# EAGLE design logic (EAGLE 9.3.1)
IGVC Motor Control Board
REVISION: v1.2; SCH_DESC: Logic Board; TEAM: IGVC

## Sheet 1 of 5: mBed Breakout
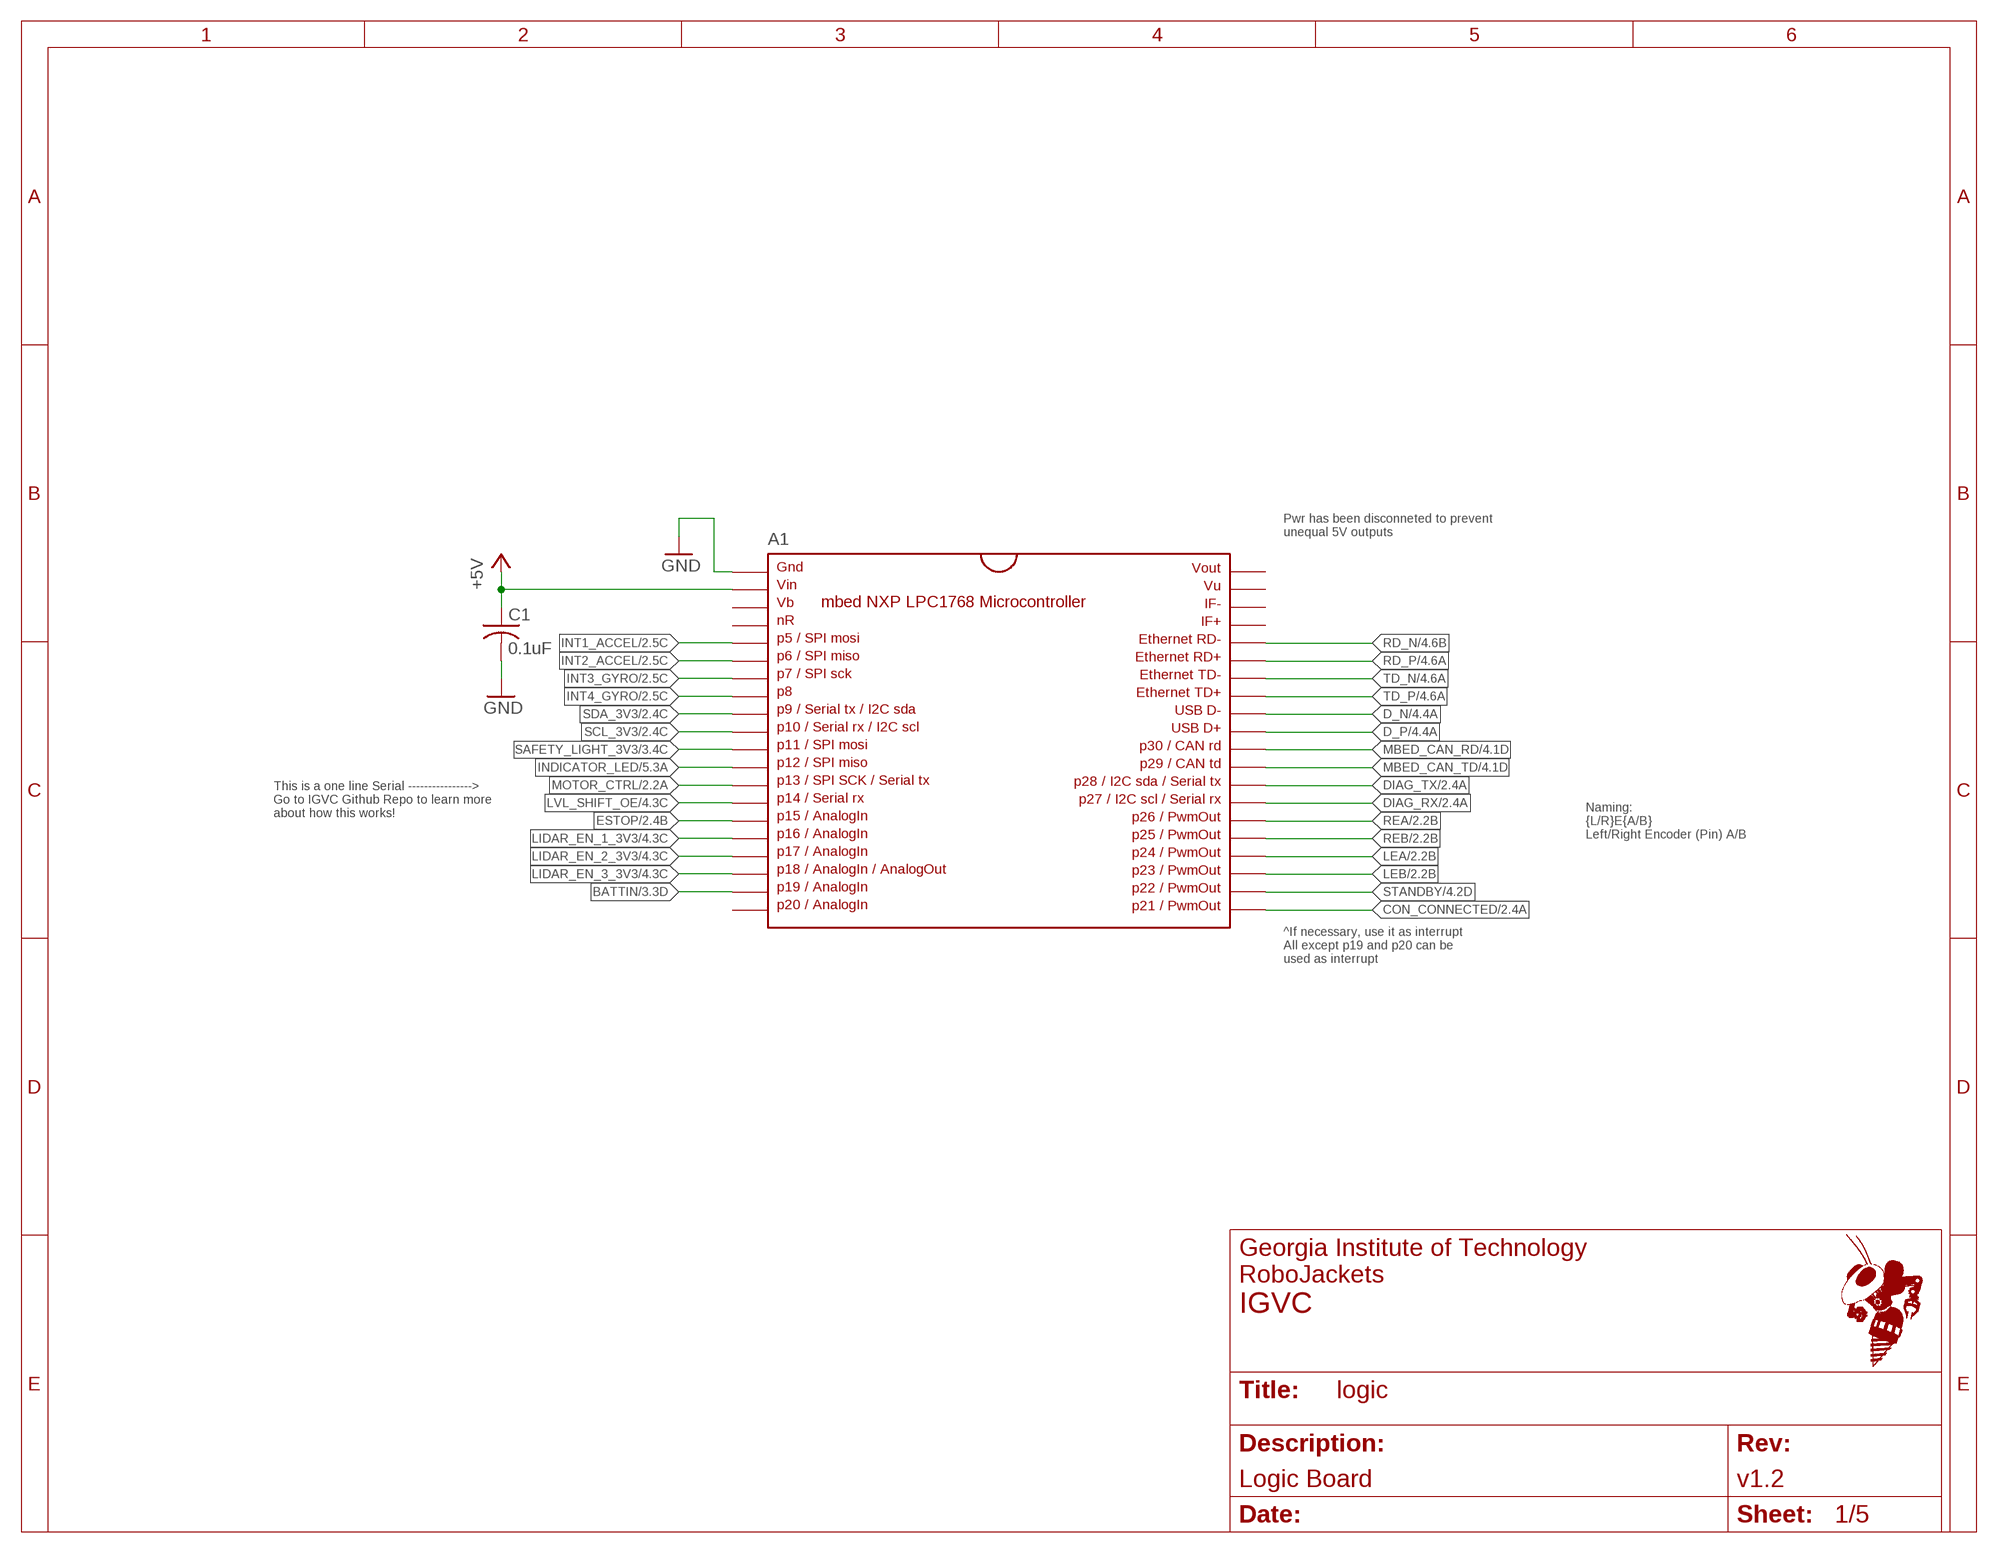
[diagram p0: schematic, sheet 1]

### Parts
A1  MBED1768  SPARKFUN-BOARDS_MBED_NXP_LPC1768  [SPARKFUN-BOARDS_DIL40_0.9]
C1  0.1uF  C-USC0603  [C0603]

### Nets
+5V: A1.2 C1.1 ; also sheet 2,3,4,5
BATTIN: A1.19 ; also sheet 3
CON_CONNECTED: A1.21 ; also sheet 2
D_N: A1.32 ; also sheet 4
D_P: A1.31 ; also sheet 4
DIAG_RX: A1.27 ; also sheet 2
DIAG_TX: A1.28 ; also sheet 2
ESTOP: A1.15 ; also sheet 2
GND: A1.1 C1.2 ; also sheet 2,3,4,5
INDICATOR_LED: A1.12 ; also sheet 5
INT1_ACCEL: A1.5 ; also sheet 2
INT2_ACCEL: A1.6 ; also sheet 2
INT3_GYRO: A1.7 ; also sheet 2
INT4_GYRO: A1.8 ; also sheet 2
LEA: A1.24 ; also sheet 2
LEB: A1.23 ; also sheet 2
LIDAR_EN_1_3V3: A1.16 ; also sheet 4
LIDAR_EN_2_3V3: A1.17 ; also sheet 4
LIDAR_EN_3_3V3: A1.18 ; also sheet 4
LVL_SHIFT_OE: A1.14 ; also sheet 4
MBED_CAN_RD: A1.30 ; also sheet 4
MBED_CAN_TD: A1.29 ; also sheet 4
MOTOR_CTRL: A1.13 ; also sheet 2
RD_N: A1.36 ; also sheet 4
RD_P: A1.35 ; also sheet 4
REA: A1.26 ; also sheet 2
REB: A1.25 ; also sheet 2
SAFETY_LIGHT_3V3: A1.11 ; also sheet 3
SCL_3V3: A1.10 ; also sheet 2,4
SDA_3V3: A1.9 ; also sheet 2,4
STANDBY: A1.22 ; also sheet 4
TD_N: A1.34 ; also sheet 4
TD_P: A1.33 ; also sheet 4
Unconnected: A1.3 A1.4 A1.20 A1.37 A1.38 A1.39 A1.40

### Notes on the sheet
- Pwr has been disconneted to prevent
  unequal 5V outputs
- This is a one line Serial ---------------->
  Go to IGVC Github Repo to learn more
  about how this works!
- Naming:
  {L/R}E{A/B}
  Left/Right Encoder (Pin) A/B
- ^If necessary, use it as interrupt
  All except p19 and p20 can be
  used as interrupt

## Sheet 2 of 5: Motor Control
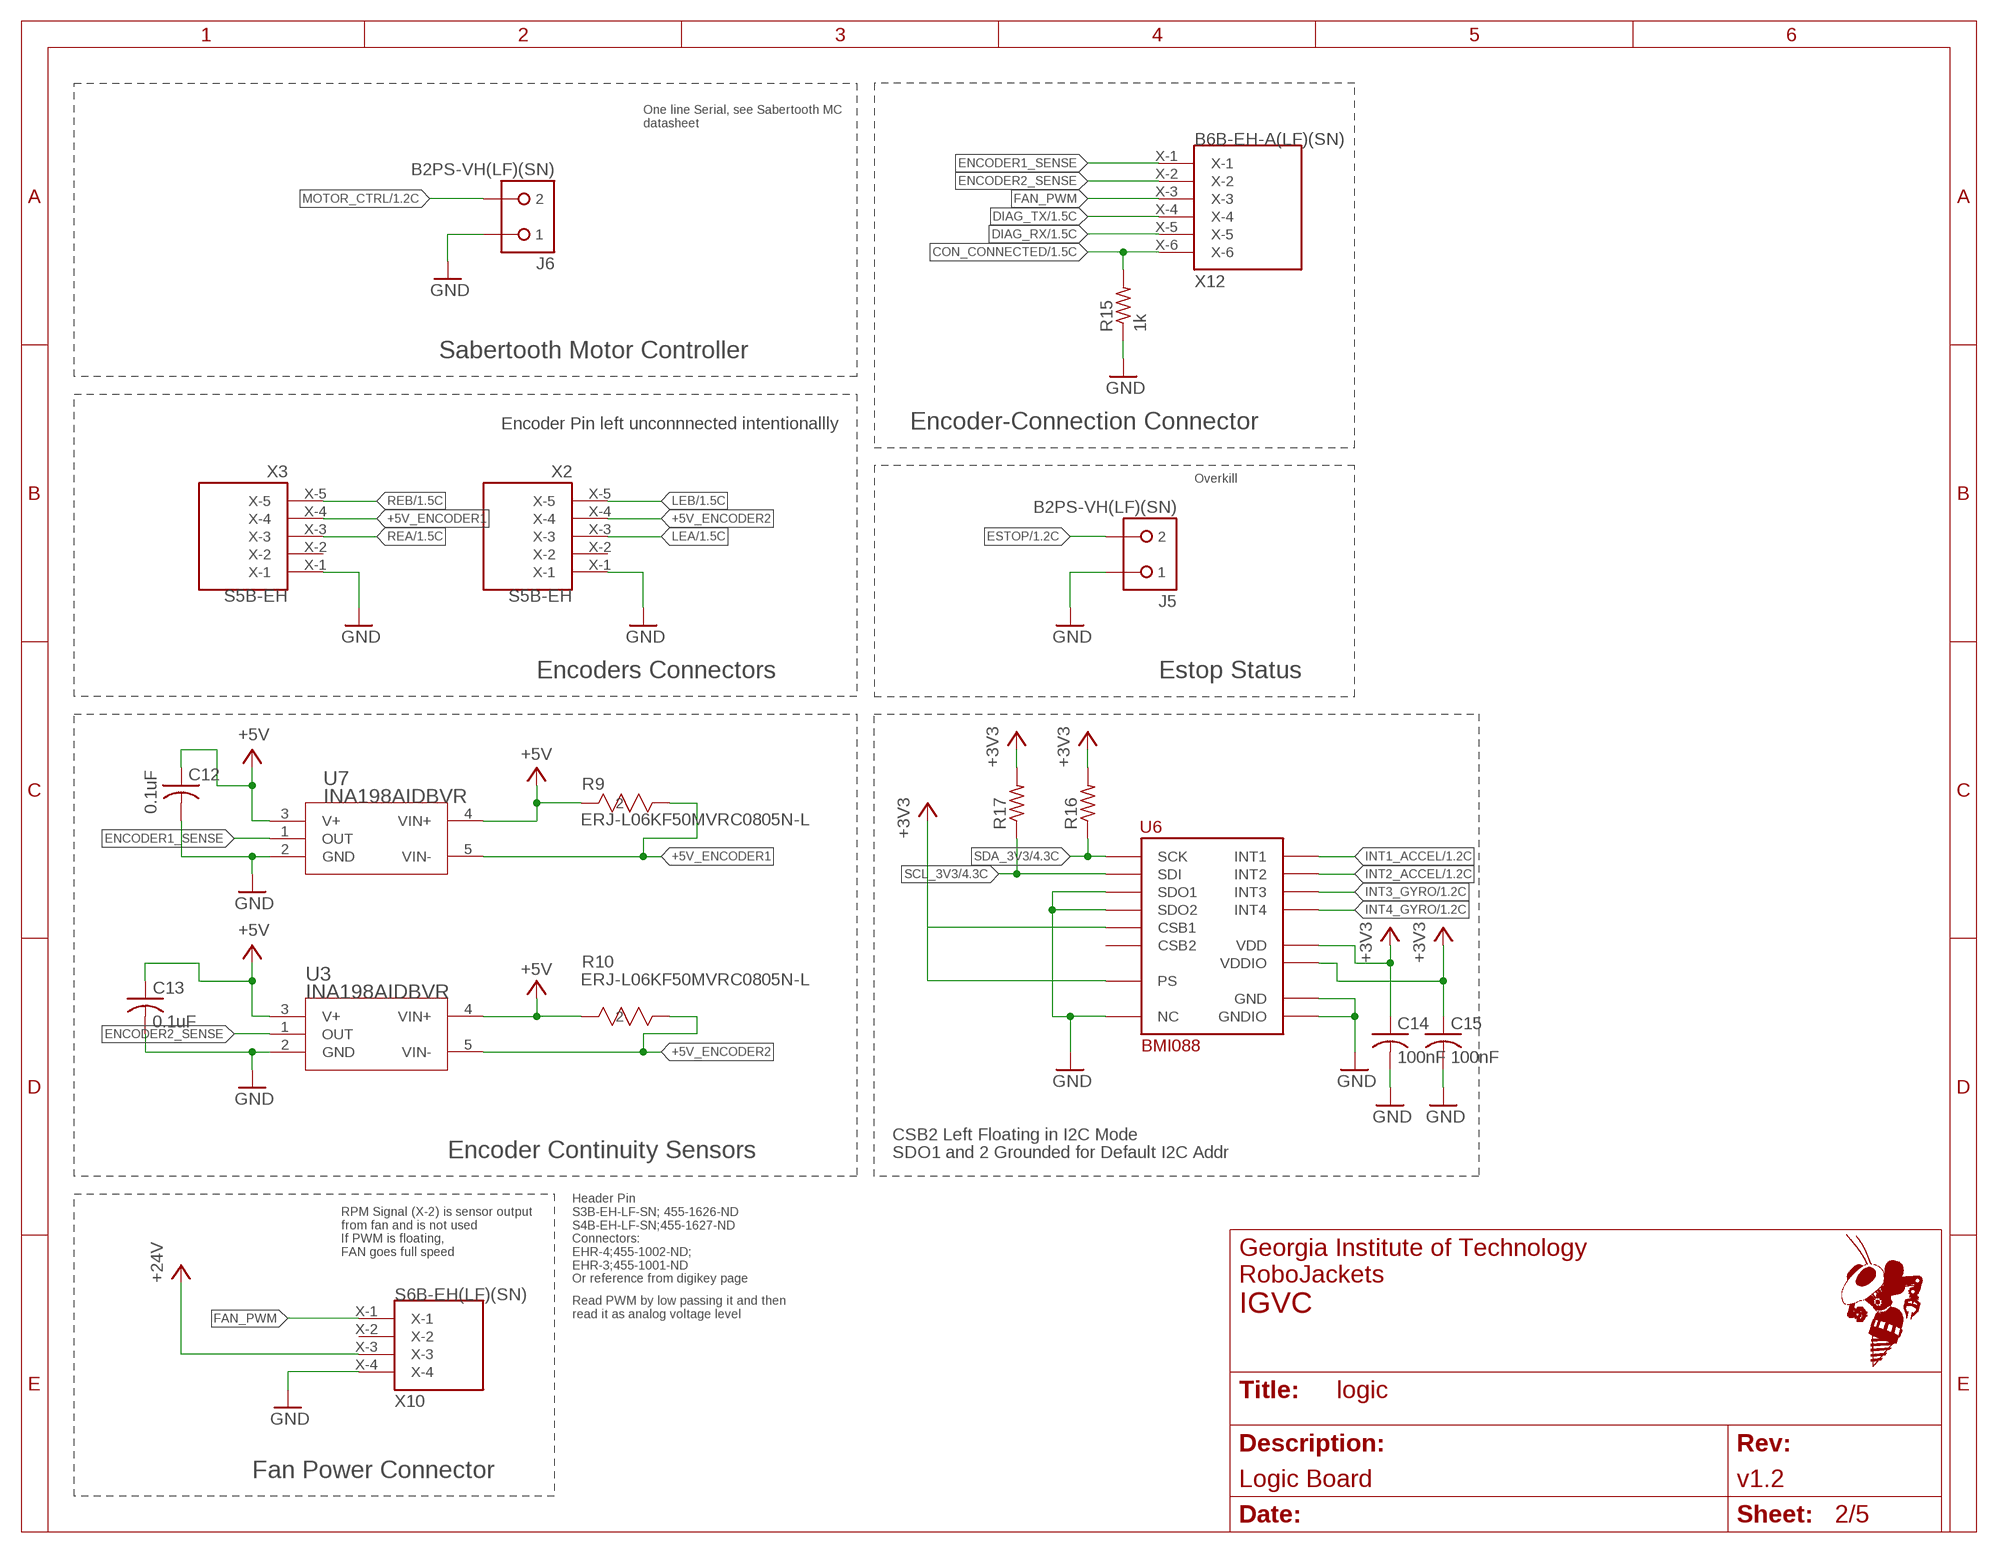
[diagram p1: schematic, sheet 2]

### Parts
C12  0.1uF  C-USC0603  [C0603]
C13  0.1uF  C-USC0603  [C0603]
C14  100nF  C-USC0603  [C0603]
C15  100nF  C-USC0603  [C0603]
J5  B2PS-VH(LF)(SN)  [B2PS-CENTERED]
J6  B2PS-VH(LF)(SN)  [B2PS-CENTERED]
R9  ERJ-L06KF50MVRC0805N-L  [RC0805N-L]
R10  ERJ-L06KF50MVRC0805N-L  [RC0805N-L]
R15  1k  R-US_R0603  [R0603]
R16  R-US_R0603  [R0603]
R17  R-US_R0603  [R0603]
U3  INA198AIDBVR  [DBV5]
U6  BMI088  [BMI088]
U7  INA198AIDBVR  [DBV5]
X2  S5B-EH  [S5BEHLFSN]
X3  S5B-EH  [S5BEHLFSN]
X10  S6B-EH(LF)(SN)  [S4BEHLFSN]
X12  B6B-EH-A(LF)(SN)  [B6BEHALFSN]

### Nets
+3V3: C14.1 C15.1 R16.2 R17.2 U6.P$3(VDD) U6.P$7(PS) U6.P$11(VDDIO) ; also sheet 3,4,5
+5V: C12.1 C13.1 R9.2 R10.2 U3.3(V+) U3.4(VIN+) U7.3(V+) U7.4(VIN+) ; also sheet 1,3,4,5
+5V_ENCODER1: R9.1 U7.5(VIN-) X3.X-4
+5V_ENCODER2: R10.1 U3.5(VIN-) X2.X-4
+24V: X10.X-3 ; also sheet 3,5
CON_CONNECTED: R15.2 X12.X-6 ; also sheet 1
DIAG_RX: X12.X-5 ; also sheet 1
DIAG_TX: X12.X-4 ; also sheet 1
ENCODER1_SENSE: U7.1(OUT) X12.X-1
ENCODER2_SENSE: U3.1(OUT) X12.X-2
ESTOP: J5.2 ; also sheet 1
FAN_PWM: X10.X-1 X12.X-3
GND: C12.2 C13.2 C14.2 C15.2 J5.1 J6.1 R15.1 U3.2(GND) U6.P$2(NC) U6.P$4(GND) U6.P$6(GNDIO) U6.P$10(SDO2) U6.P$15(SDO1) U7.2(GND) X2.X-1 X3.X-1 X10.X-4 ; also sheet 1,3,4,5
INT1_ACCEL: U6.P$16(INT1) ; also sheet 1
INT2_ACCEL: U6.P$1(INT2) ; also sheet 1
INT3_GYRO: U6.P$12(INT3) ; also sheet 1
INT4_GYRO: U6.P$13(INT4) ; also sheet 1
LEA: X2.X-3 ; also sheet 1
LEB: X2.X-5 ; also sheet 1
MOTOR_CTRL: J6.2 ; also sheet 1
N$17: U6.P$14(CSB1)
REA: X3.X-3 ; also sheet 1
REB: X3.X-5 ; also sheet 1
SCL_3V3: R17.1 U6.P$9(SDI) ; also sheet 1,4
SDA_3V3: R16.1 U6.P$8(SCK) ; also sheet 1,4
Unconnected: U6.P$5(CSB2) X2.X-2 X3.X-2 X10.X-2

### Notes on the sheet
- One line Serial, see Sabertooth MC 
  datasheet
- Sabertooth Motor Controller
- Encoder Pin left unconnnected intentionallly | Encoder-Connection Connector
- Overkill
- Encoders Connectors | Estop Status
- CSB2 Left Floating in I2C Mode
- Encoder Continuity Sensors | SDO1 and 2 Grounded for Default I2C Addr
- RPM Signal (X-2) is sensor output
  from fan and is not used
- If PWM is floating,
  FAN goes full speed
- Header Pin
  S3B-EH-LF-SN; 455-1626-ND
  S4B-EH-LF-SN;455-1627-ND
  Connectors:
  EHR-4;455-1002-ND;
  EHR-3;455-1001-ND
  Or reference from digikey page
- Read PWM by low passing it and then
  read it as analog voltage level
- Fan Power Connector

## Sheet 3 of 5: Light Control
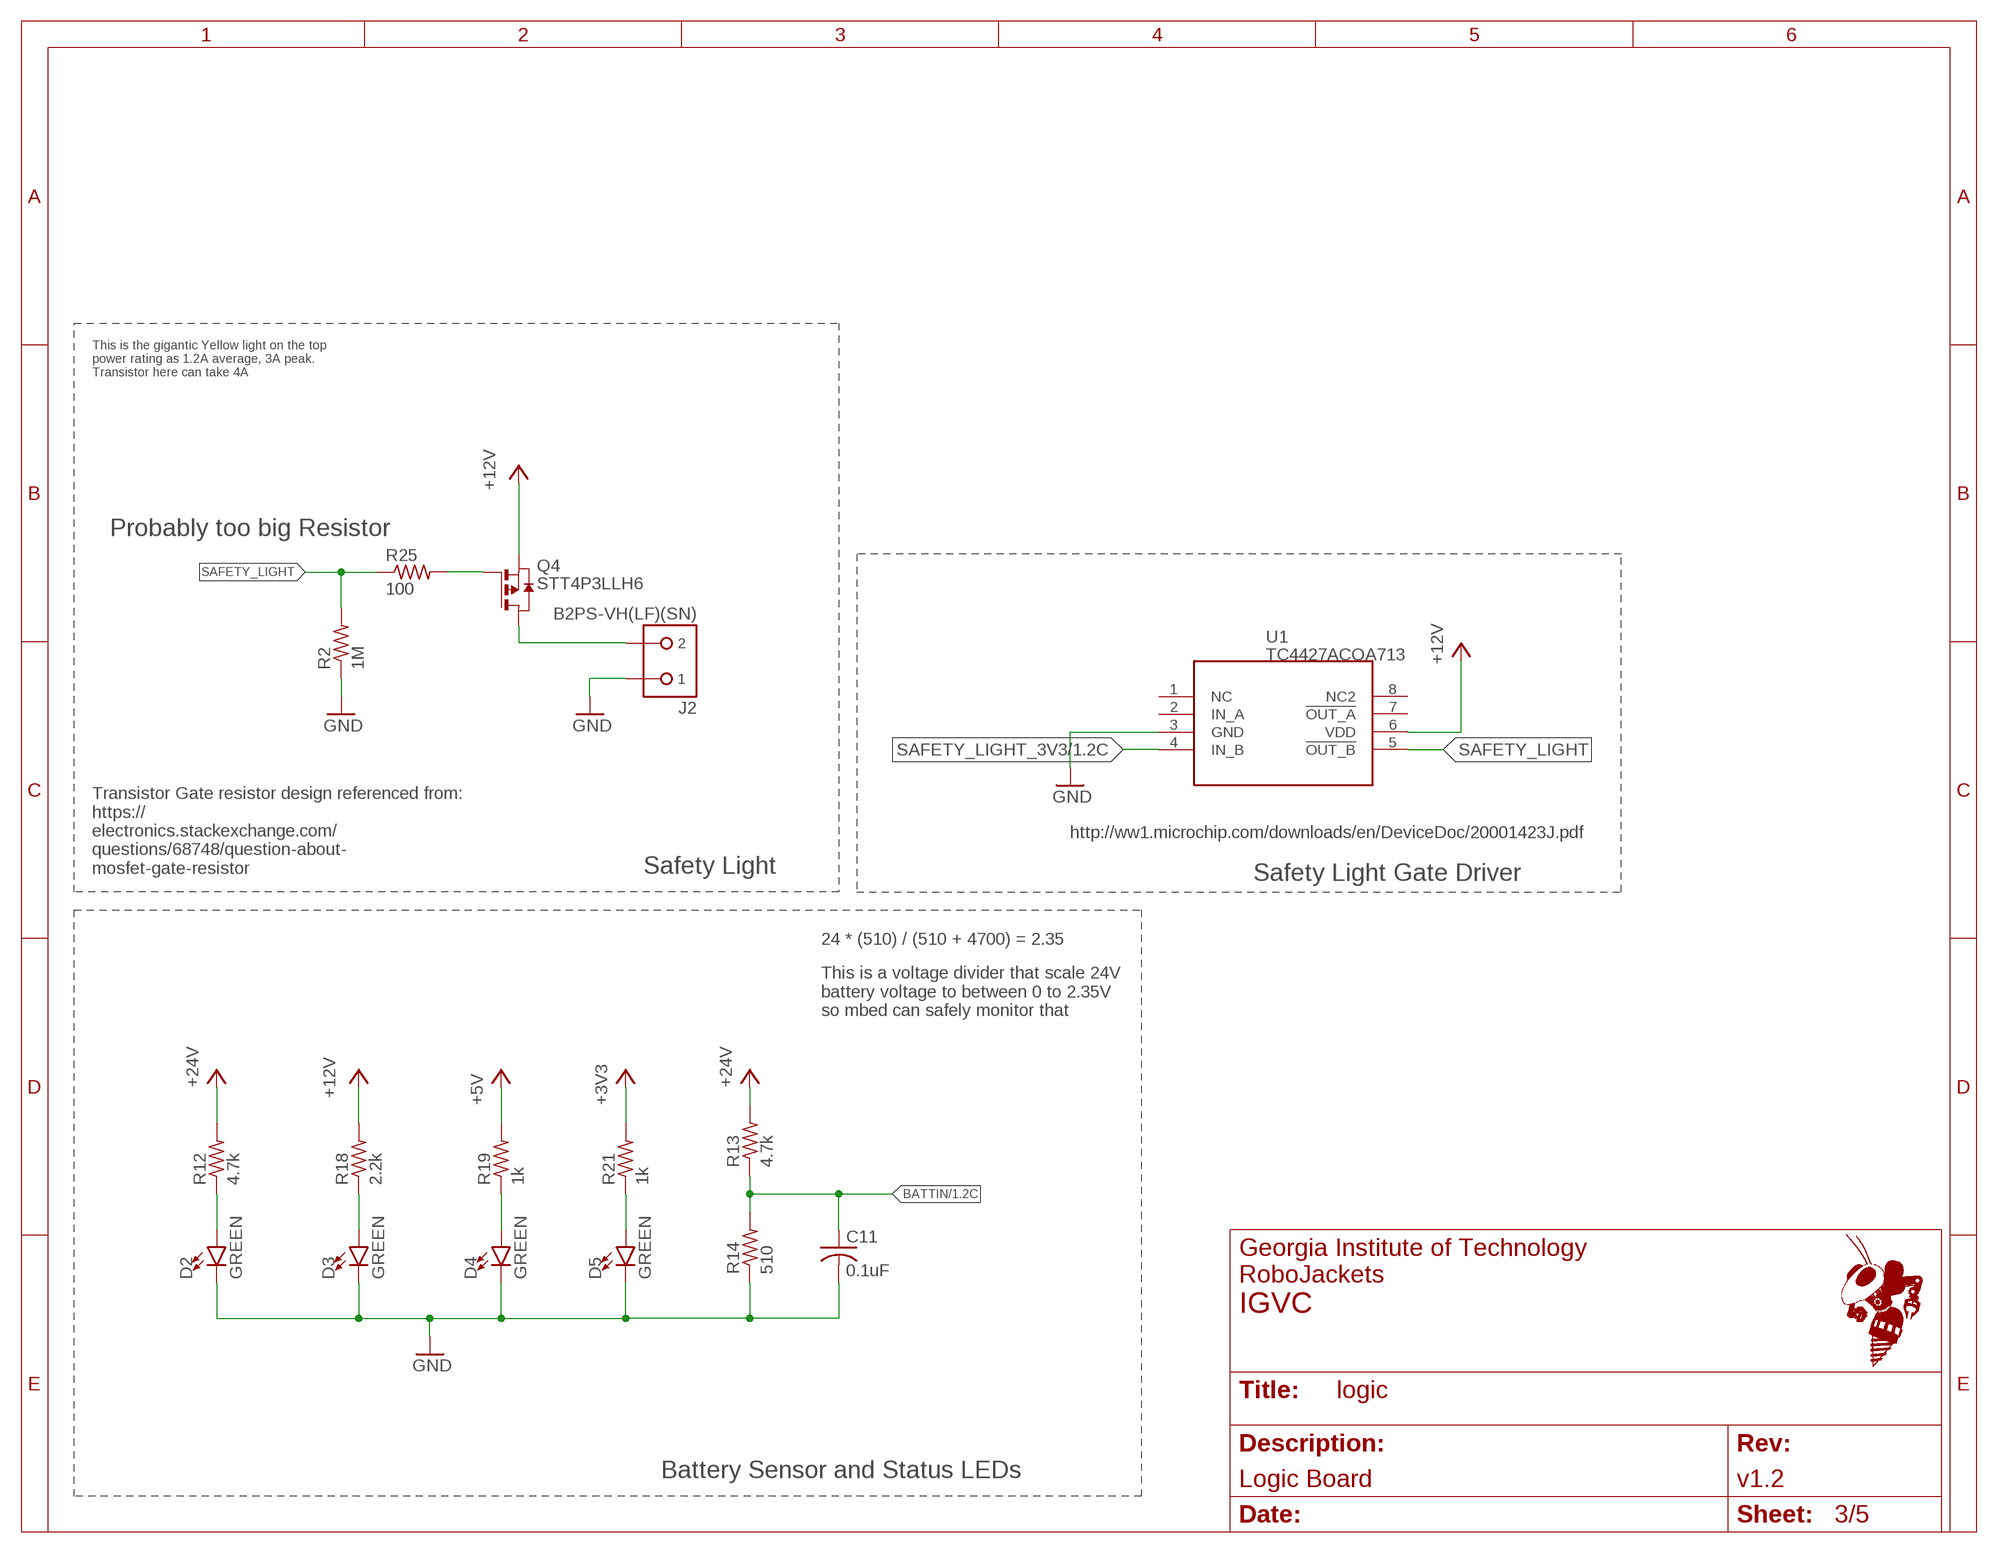
[diagram p2: schematic, sheet 3]

### Parts
C11  0.1uF  C-USC0603  [C0603]
D2  GREEN  LED-BLUE0603  [LED-0603]
D3  GREEN  LED-BLUE0603  [LED-0603]
D4  GREEN  LED-GREEN0603  [LED-0603]
D5  GREEN  LED-GREEN0603  [LED-0603]
J2  B2PS-VH(LF)(SN)  [B2PS-CENTERED]
Q4  STT4P3LLH6  [SOT23-6]
R2  1M  R-US_R0603  [R0603]
R12  4.7k  R-US_R0603  [R0603]
R13  4.7k  R-US_R0603  [R0603]
R14  510  R-US_R0603  [R0603]
R18  2.2k  R-US_R0603  [R0603]
R19  1k  R-US_R0603  [R0603]
R21  1k  R-US_R0603  [R0603]
R25  100  R-US_R0603  [R0603]
U1  TC4427ACOA713  [SOIC-8]

### Nets
3V3_LED_R: D5.A R21.1
5V_LED_R: D4.A R19.1
12V_LED_R: D3.A R18.1
+3V3: R21.2 ; also sheet 2,4,5
+5V: R19.2 ; also sheet 1,2,4,5
+12V: Q4.4(S) R18.2 U1.6(VDD) ; also sheet 5
+24V: R12.2 R13.2 ; also sheet 2,5
BATTIN: C11.1 R13.1 R14.2 ; also sheet 1
GND: C11.2 D2.C D3.C D4.C D5.C J2.1 R2.1 R14.1 U1.3(GND) ; also sheet 1,2,4,5
N$1: D2.A R12.1
SAFETY_HRD: J2.2 Q4.1(D) Q4.2(D) Q4.5(D) Q4.6(D)
SAFETY_LIGHT: R2.2 R25.1 U1.5(!OUT_B)
SAFETY_LIGHT_3V3: U1.4(IN_B) ; also sheet 1
SAFETY_R: Q4.3(G) R25.2
Unconnected: U1.1(NC) U1.2(IN_A) U1.7(!OUT_A) U1.8(NC2)

### Notes on the sheet
- This is the gigantic Yellow light on the top
  power rating as 1.2A average, 3A peak.
  Transistor here can take 4A
- Probably too big Resistor
- http://ww1.microchip.com/downloads/en/DeviceDoc/20001423J.pdf
- Transistor Gate resistor design referenced from:
  https://
  electronics.stackexchange.com/
  questions/68748/question-about-
  mosfet-gate-resistor
- Safety Light
- Safety Light Gate Driver
- 24 * (510) / (510 + 4700) = 2.35
- This is a voltage divider that scale 24V
  battery voltage to between 0 to 2.35V
  so mbed can safely monitor that
- Battery Sensor and Status LEDs

## Sheet 4 of 5: Sensor and Comm
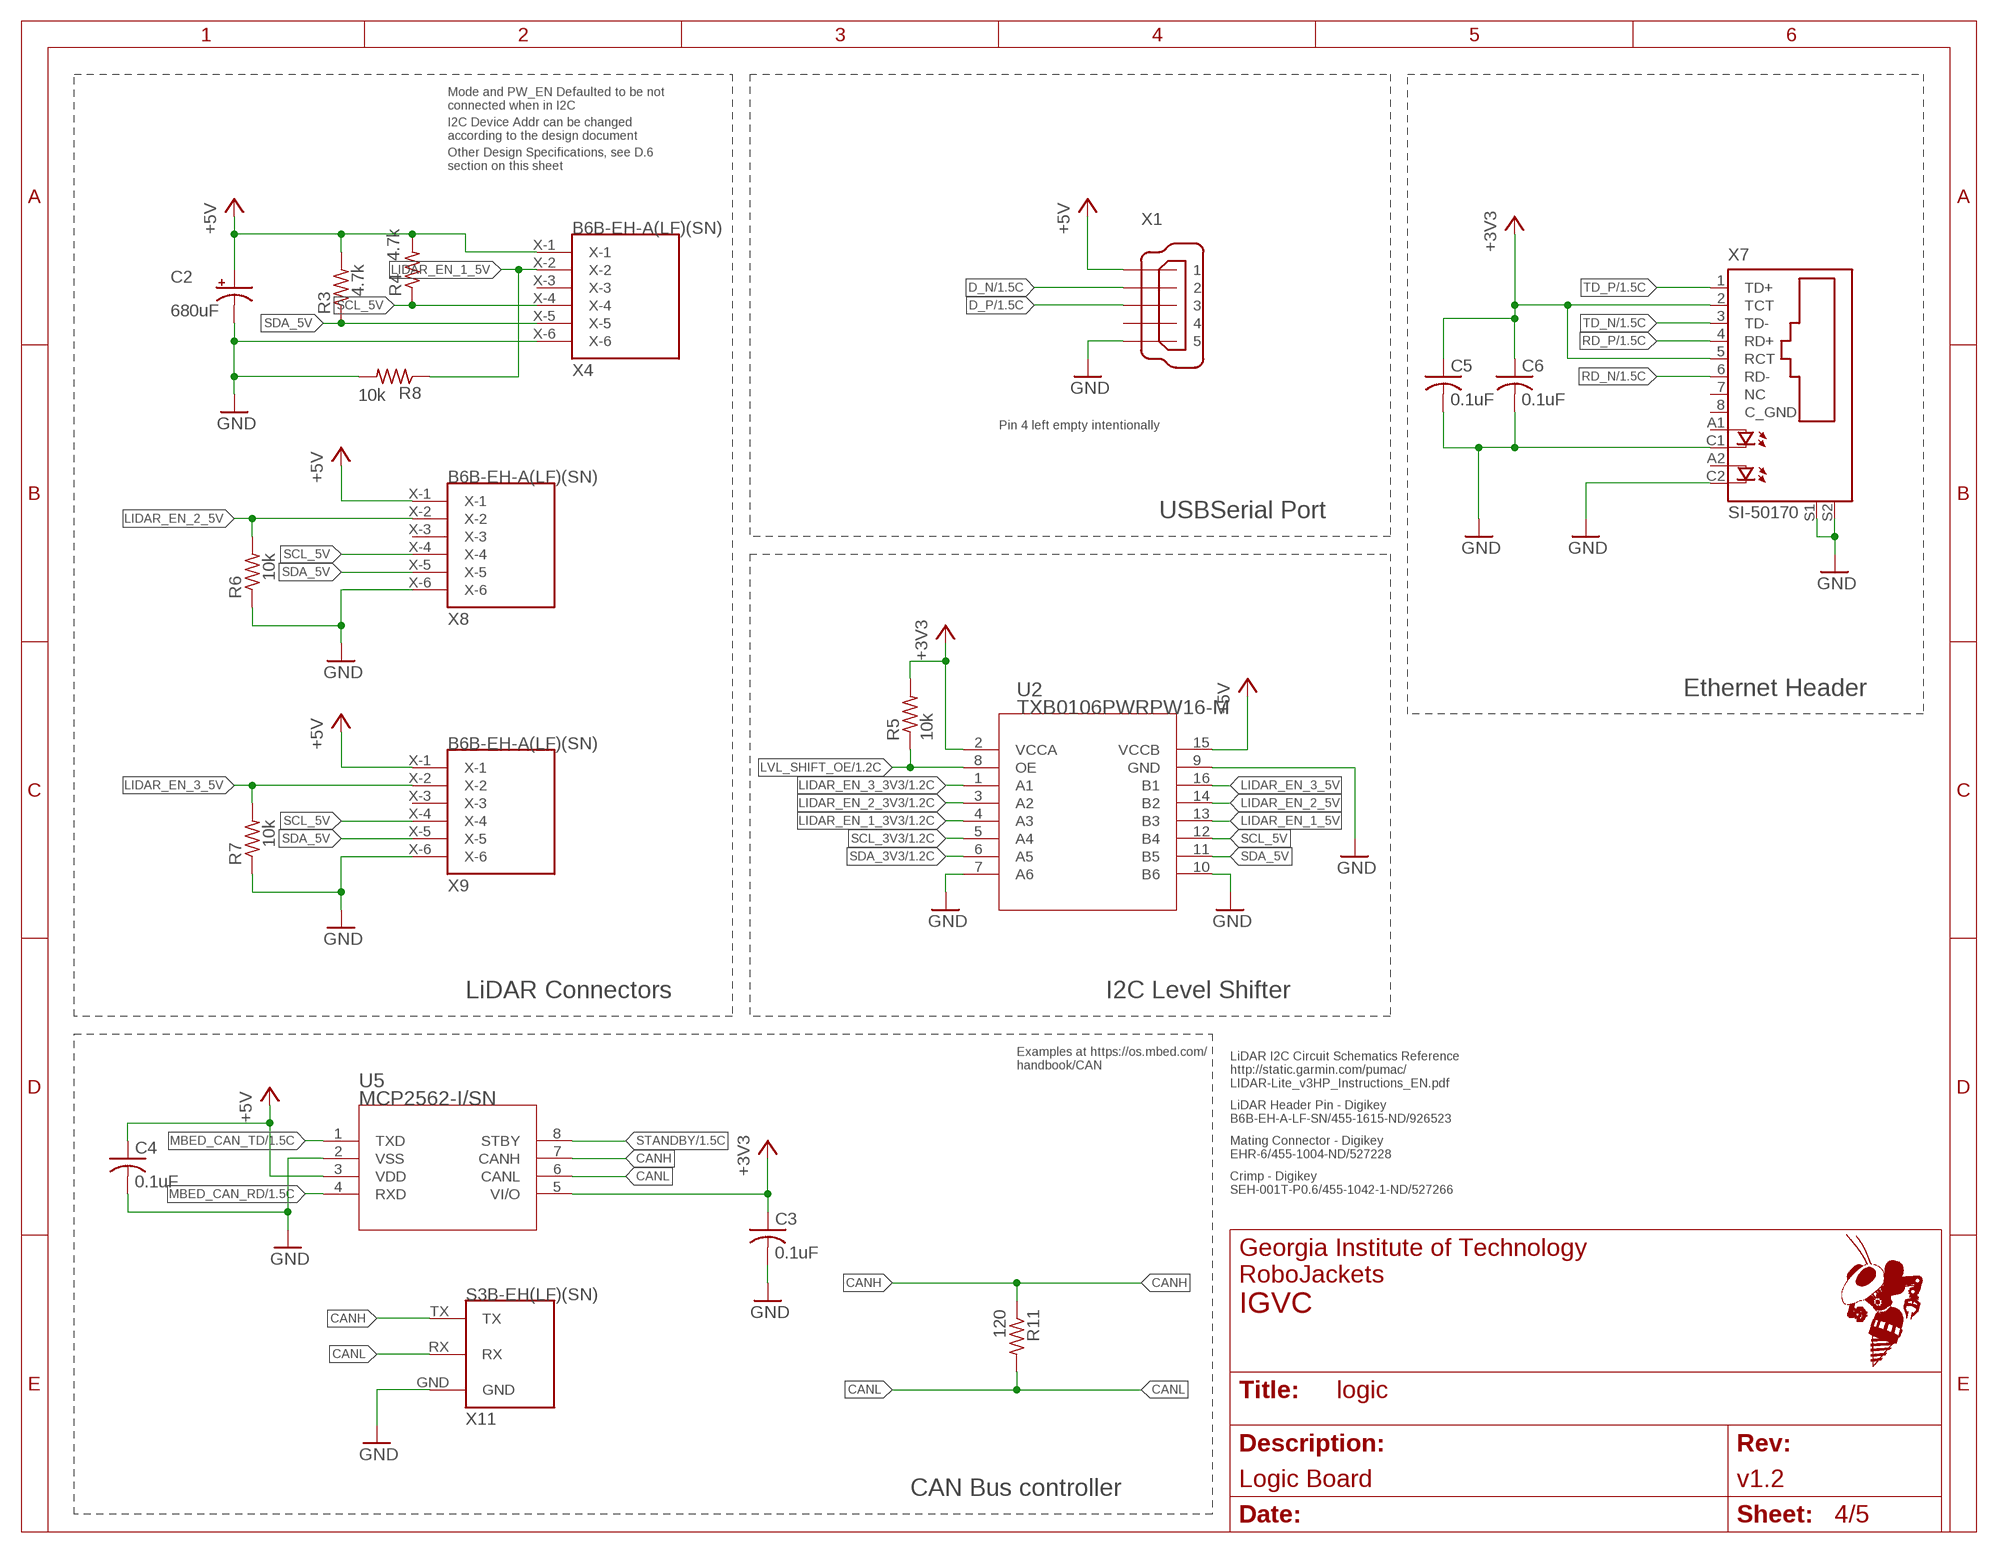
[diagram p3: schematic, sheet 4]

### Parts
C2  680uF  CPOL-USE5-5  [E5-5]
C3  0.1uF  C-USC0603  [C0603]
C4  0.1uF  C-USC0603  [C0603]
C5  0.1uF  C-USC0603  [C0603]
C6  0.1uF  C-USC0603  [C0603]
R3  4.7k  R-US_R0603  [R0603]
R4  4.7k  R-US_R0603  [R0603]
R5  10k  R-US_R0603  [R0603]
R6  10k  R-US_R0603  [R0603]
R7  10k  R-US_R0603  [R0603]
R8  10k  R-US_R0603  [R0603]
R11  120  R-US_R0603  [R0603]
U2  TXB0106PWRPW16-M  [PW16-M]
U5  MCP2562-I/SN  [SOIC8-N_MC]
X1  MINI-USB_SHIELD5P4-32005-400  [32005-400]
X4  B6B-EH-A(LF)(SN)  [B6BEHALFSN]
X7  SI-50170  [SI-50170]
X8  B6B-EH-A(LF)(SN)  [B6BEHALFSN]
X9  B6B-EH-A(LF)(SN)  [B6BEHALFSN]
X11  S3B-EH(LF)(SN)  [S3BEHLFSN]

### Nets
+3V3: C3.1 C5.1 C6.1 R5.2 U2.2(VCCA) U5.5(VI/O) X7.2(TCT) X7.5(RCT) ; also sheet 2,3,5
+5V: C2.+ C4.1 R3.2 R4.2 U2.15(VCCB) U5.3(VDD) X1.1 X4.X-1 X8.X-1 X9.X-1 ; also sheet 1,2,3,5
CANH: R11.1 U5.7(CANH) X11.TX
CANL: R11.2 U5.6(CANL) X11.RX
D_N: X1.2 ; also sheet 1
D_P: X1.3 ; also sheet 1
GND: C2.- C3.2 C4.2 C5.2 C6.2 R6.1 R7.1 R8.2 U2.7(A6) U2.9(GND) U2.10(B6) U5.2(VSS) X1.5 X4.X-6 X7.C1(C) X7.C2(C1) X7.S1 X7.S2 X8.X-6 X9.X-6 X11.GND ; also sheet 1,2,3,5
LIDAR_EN_1_3V3: U2.4(A3) ; also sheet 1
LIDAR_EN_1_5V: R8.1 U2.13(B3) X4.X-2
LIDAR_EN_2_3V3: U2.3(A2) ; also sheet 1
LIDAR_EN_2_5V: R6.2 U2.14(B2) X8.X-2
LIDAR_EN_3_3V3: U2.1(A1) ; also sheet 1
LIDAR_EN_3_5V: R7.2 U2.16(B1) X9.X-2
LVL_SHIFT_OE: R5.1 U2.8(OE) ; also sheet 1
MBED_CAN_RD: U5.4(RXD) ; also sheet 1
MBED_CAN_TD: U5.1(TXD) ; also sheet 1
RD_N: X7.6(RD-) ; also sheet 1
RD_P: X7.4(RD+) ; also sheet 1
SCL_3V3: U2.5(A4) ; also sheet 1,2
SCL_5V: R4.1 U2.12(B4) X4.X-4 X8.X-4 X9.X-4
SDA_3V3: U2.6(A5) ; also sheet 1,2
SDA_5V: R3.1 U2.11(B5) X4.X-5 X8.X-5 X9.X-5
STANDBY: U5.8(STBY) ; also sheet 1
TD_N: X7.3(TD-) ; also sheet 1
TD_P: X7.1(TD+) ; also sheet 1
Unconnected: X1.4 X1.M1(S1) X1.M2(S2) X1.M3(S3) X1.M4(S4) X4.X-3 X7.7(NC) X7.8(C_GND) X7.A1(A) X7.A2(A1) X8.X-3 X9.X-3

### Notes on the sheet
- Mode and PW_EN Defaulted to be not
  connected when in I2C
- I2C Device Addr can be changed
  according to the design document
- Other Design Specifications, see D.6
  section on this sheet
- Pin 4 left empty intentionally
- USBSerial Port
- Ethernet Header
- LiDAR Connectors | I2C Level Shifter
- Examples at https://os.mbed.com/
  handbook/CAN
- LiDAR I2C Circuit Schematics Reference
  http://static.garmin.com/pumac/
  LIDAR-Lite_v3HP_Instructions_EN.pdf
- LiDAR Header Pin - Digikey
  B6B-EH-A-LF-SN/455-1615-ND/926523
- Mating Connector - Digikey
  EHR-6/455-1004-ND/527228
- Crimp - Digikey
  SEH-001T-P0.6/455-1042-1-ND/527266
- CAN Bus controller

## Sheet 5 of 5: Misc.
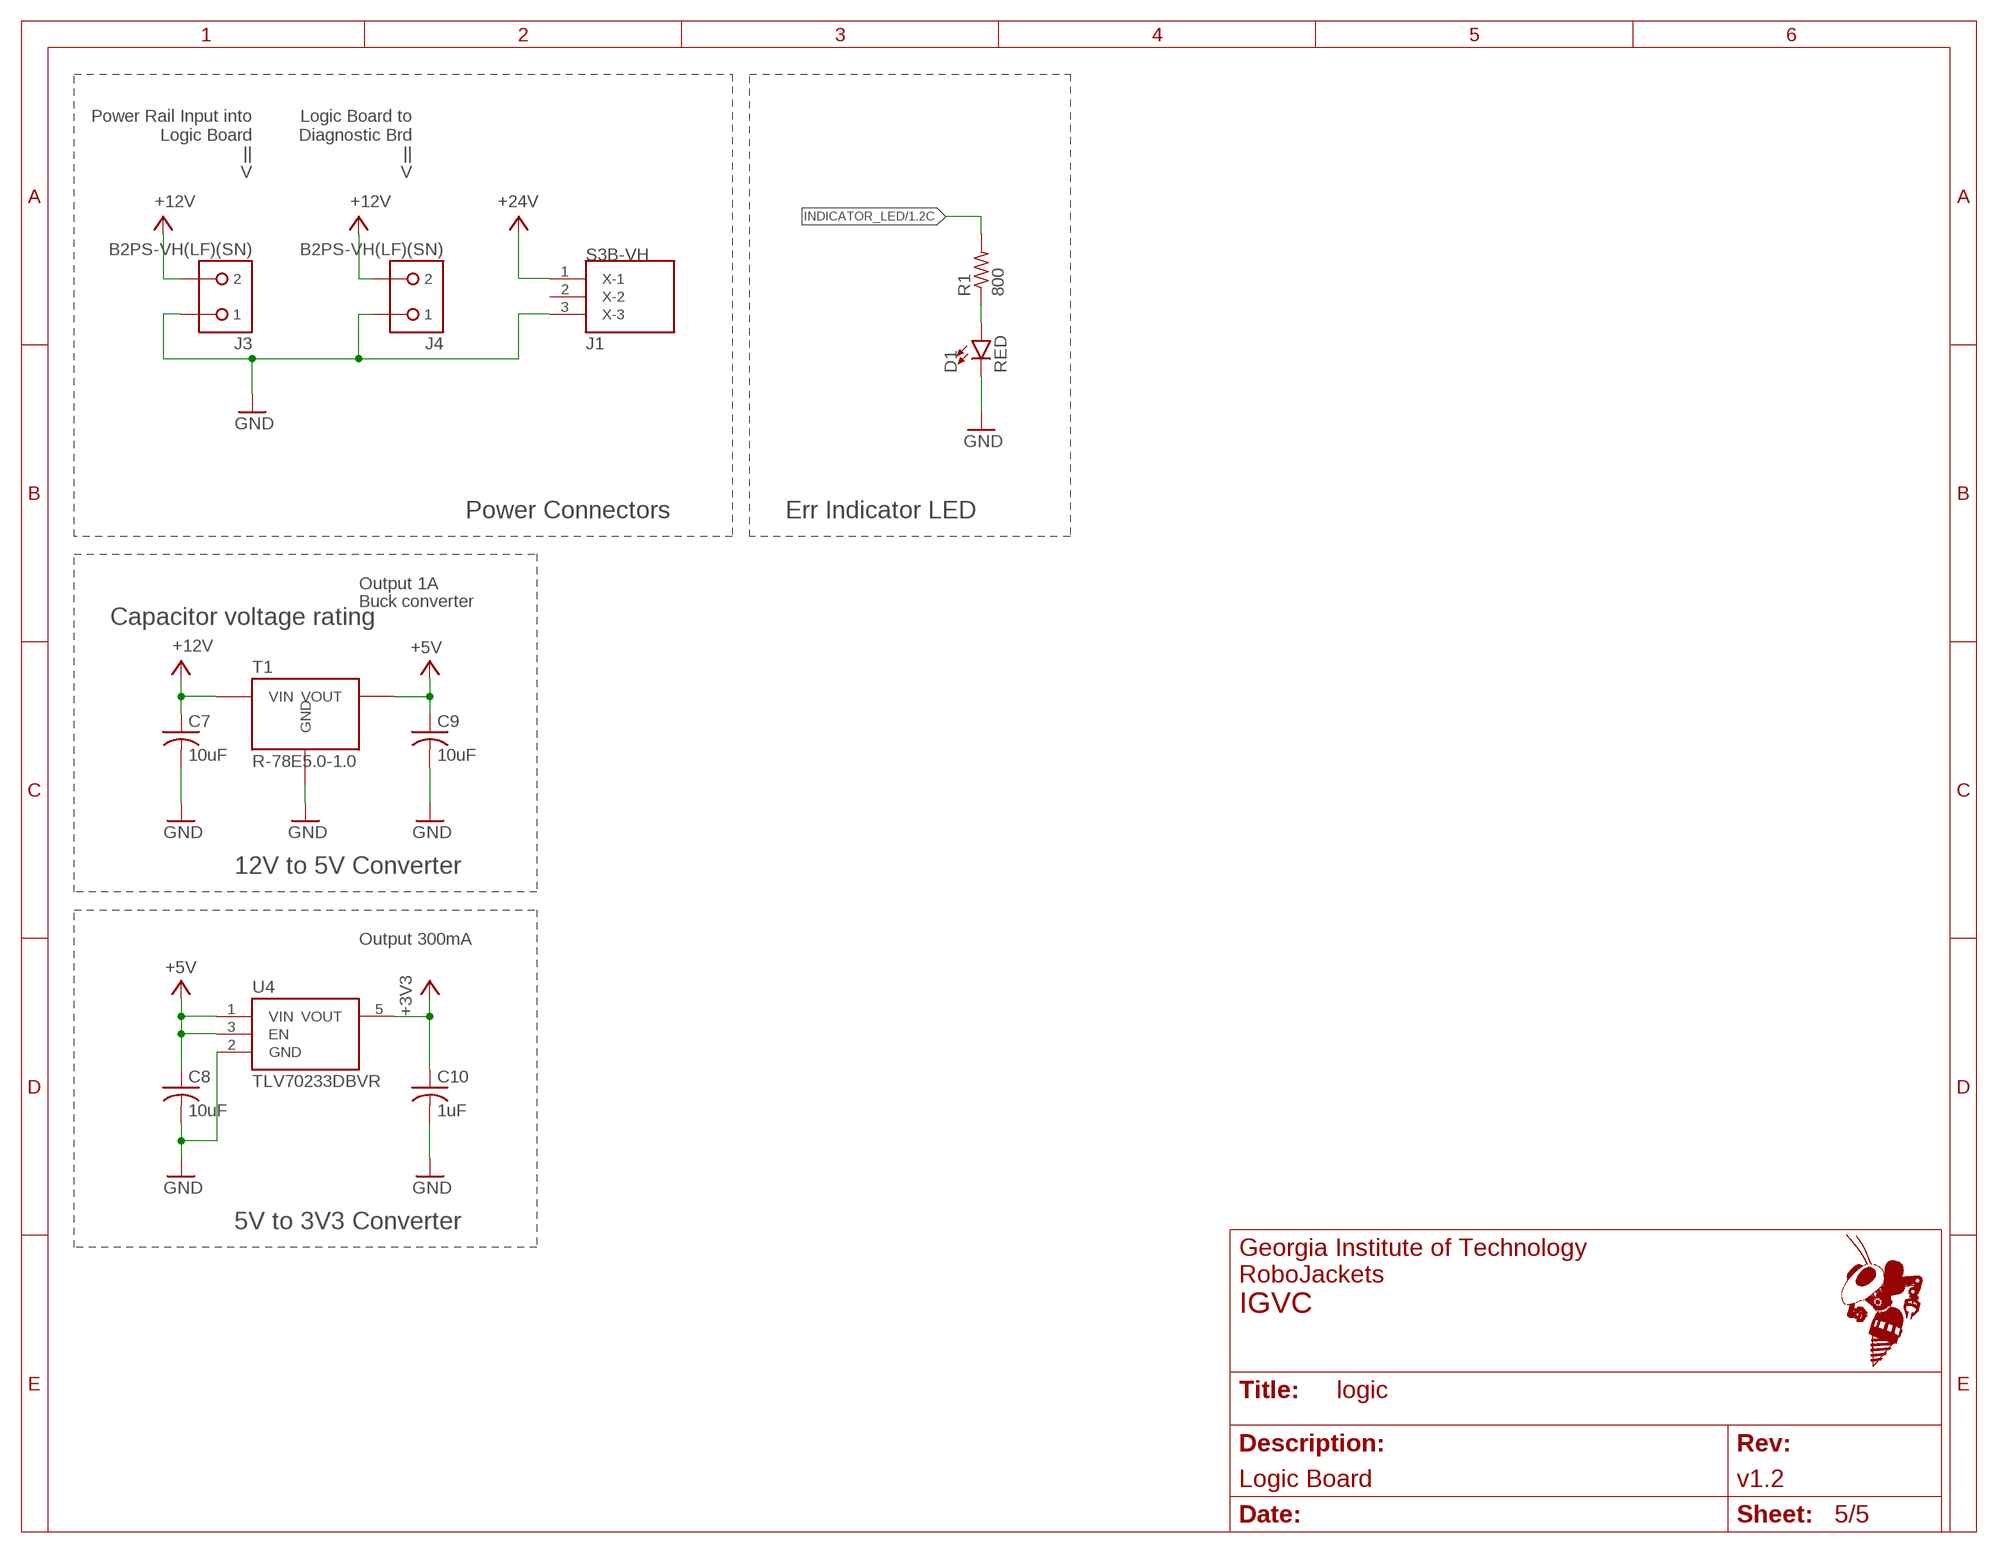
[diagram p4: schematic, sheet 5]

### Parts
C7  10uF  C-USC0805  [C0805]
C8  10uF  C-USC0805  [C0805]
C9  10uF  C-USC0805  [C0805]
C10  1uF  C-USC0805  [C0805]
D1  RED  LED-BLUE0603  [LED-0603]
J1  S3B-VH  [S3B-VH]
J3  B2PS-VH(LF)(SN)  [B2PS-CENTERED]
J4  B2PS-VH(LF)(SN)  [B2PS-CENTERED]
R1  800  R-US_R0603  [R0603]
T1  R-78E5.0-1.0  [R-78E]
U4  TLV70233DBVR  [SOT-23-5]

### Nets
+3V3: C10.1 U4.5(VOUT) ; also sheet 2,3,4
+5V: C8.1 C9.1 T1.3(VOUT) U4.1(VIN) U4.3(EN) ; also sheet 1,2,3,4
+12V: C7.1 J3.2 J4.2 T1.1(VIN) ; also sheet 3
+24V: J1.1(X-1) ; also sheet 2,3
GND: C7.2 C8.2 C9.2 C10.2 D1.C J3.1 J4.1 T1.2(GND) U4.2(GND) ; also sheet 1,2,3,4
INDICATOR_LED: R1.2 ; also sheet 1
N$2: D1.A R1.1
N$3: J1.3(X-3)
Unconnected: J1.2(X-2)

### Notes on the sheet
- Power Rail Input into
  Logic Board
               ||
               V
- Logic Board to
  Diagnostic Brd
               ||
               V
- Power Connectors | Err Indicator LED
- Output 1A
- Buck converter
- Capacitor voltage rating
- 12V to 5V Converter
- Output 300mA
- 5V to 3V3 Converter

## Library data of the parts
A1 = MotorBoardDev:SPARKFUN-BOARDS_MBED_NXP_LPC1768: mbed LPC1768 board footprint Boards using this footprint: mbed - LPC1768 (Cortex-M3) (DEV-09564); PROD_ID: COMP-12167
C1 C3-C15 = rcl:C-US: CAPACITOR, American symbol; SPICEPREFIX: C
C2 = rcl:CPOL-US: POLARIZED CAPACITOR, American symbol; SPICEPREFIX: C
D1-D3 = SparkFun-LED:LED-BLUE: Blue SMD LED Used in manufacturing of various products at SparkFun Packages: 0603 - SMD 0603 package [Product Link] <http://www.digikey.com/product-detail/en/SMLE12BC7TT86/511-1589-2-ND/1641808> 1206 - SMD1206 package [Product Link] <http://www.digikey.com/product-detail/en/lite-on-inc/LTST-C150TBKT/160-1643-1-ND/573584> SparkFun Products: ESP8266 Thing-Dev Board <https://www.sparkfun.com/products/13711> RedBoard <https://www.sparkfun.com/products/12757>; PROD_ID: DIO-08575; VALUE: BLUE
D4 D5 = SparkFun-LED:LED-GREEN: Green SMD LED Used in manufacturing of various products at SparkFun Packages: 0603 - SMD 0603 package [Product Link] <http://www.futureelectronics.com/en/technologies/semiconductors/optoelectronics/leds/Pages/9894312-LTST-C190GKT.aspx?CrossPart=HSMG-C190&IM=0> LilyPad 1206 - SMD1206 LilyPad package [Product Link] <http://www.futureelectronics.com/en/Technologies/Product.aspx?ProductID=IN150NGHARVATEKCORPORATION2049943&IM=0> 1206 - SMD1206 package [Product Link] <http://www.futureelectronics.com/en/technologies/semiconductors/optoelectronics/leds/Pages/8315665-LTST-C150KGKT.aspx?IM=0> 1206 Bottom Mount -SMD 1206 Bottom Mount [Product Link] <http://www.digikey.com/product-detail/en/lite-on-inc/LTST-C230KGKT/160-1456-1-ND/386854> SparkFun Products: Pro Mini 328 -5V <https://www.sparkfun.com/products/821> RedBoard <https://www.sparkfun.com/products/12757> MP3 Trigger <https://www.sparkfun.com/products/13720> Makey Makey <https://www.sparkfun.com/products/11076>; PROD_ID: DIO-00821
J1 = IGVC-Connector:S3B-VH
J2-J6 = RoboJackets-Connectors:B2P?-VH(LF)(SN): Power Connector Brand: JST Sales America Inc. <https://www.jst.com/> Series: VH <http://www.digikey.com/product-search/en?FV=fff40016,fff802f3,ffec0e9d> Distributor: Digi-Key <http://www.digikey.com/product-detail/en/B2PS-VH%28LF%29%28SN%29/455-1648-ND/926555>; DIGIKEY: 455-1648-ND; MPN: B2PS-VH(LF)(SN)
Q4 = MotorBoardDev:STT4P3LLH6
R1-R8 R11-R19 R21 R25 = rcl:R-US_: RESISTOR, American symbol; SPICEPREFIX: R
R9 R10 = IGVC-Discrete:ERJ-L06KF50MV; MANUFACTURER_PART_NUMBER: ERJL06KF50MV; VENDOR: Panasonic
T1 = MotorBoardDev:R-78E5.0-1.0
U1 = MotorBoardDev:TC4427ACOA713
U2 = IGVC-IC:TXB0106PWR; MANUFACTURER_PART_NUMBER: TXB0106PWR; VENDOR: Texas Instruments
U3 U7 = IGVC-Sensor:INA198AIDBVR; MANUFACTURER_PART_NUMBER: INA198AIDBVR; VENDOR: Texas Instruments
U4 = RoboJackets-PowerICs:TLV70233; DIGIKEY: 296-32415-1-ND; MPN: TLV70233DBVR
U5 = IGVC-Microcontroller:MCP2562-I/SN
U6 = IGVC-IC:BMI088
X1 = con-cypressindustries:MINI-USB_SHIELD5P4-: MINI USB-B R/A W/O POST 5 pol. Source: www.cypressindustries.com; OC_FARNELL: unknown; OC_NEWARK: unknown
X2 X3 = IGVC-Connector:S5B-EH
X4 X8 X9 X12 = IGVC-Connector:B6B-EH-A(LF)(SN)
X7 = con-stewart:SI-50170: Ethernet Connector MagJack (R) Source: www.stewartconnector.com .. si-50170.pdf; OC_FARNELL: unknown; OC_NEWARK: unknown
X10 = IGVC-Connector:S6B-EH(LF)(SN)
X11 = IGVC-Connector:S3B-EH(LF)(SN)

## Board
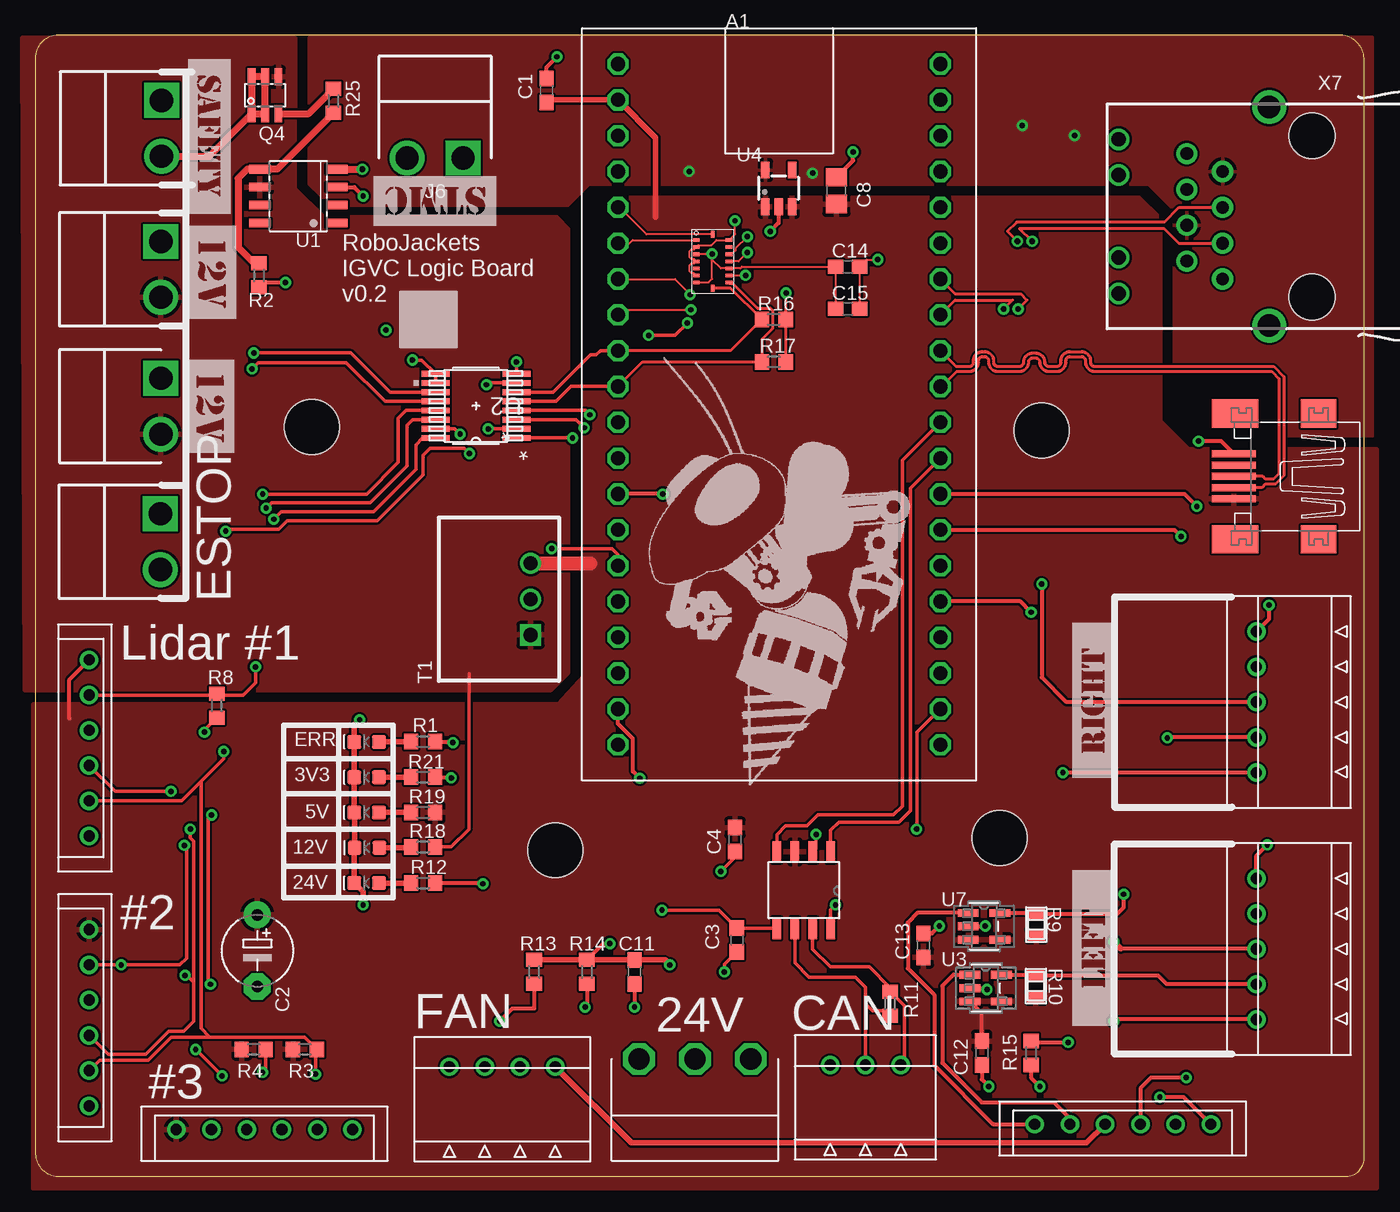
[diagram p5: board, top side]
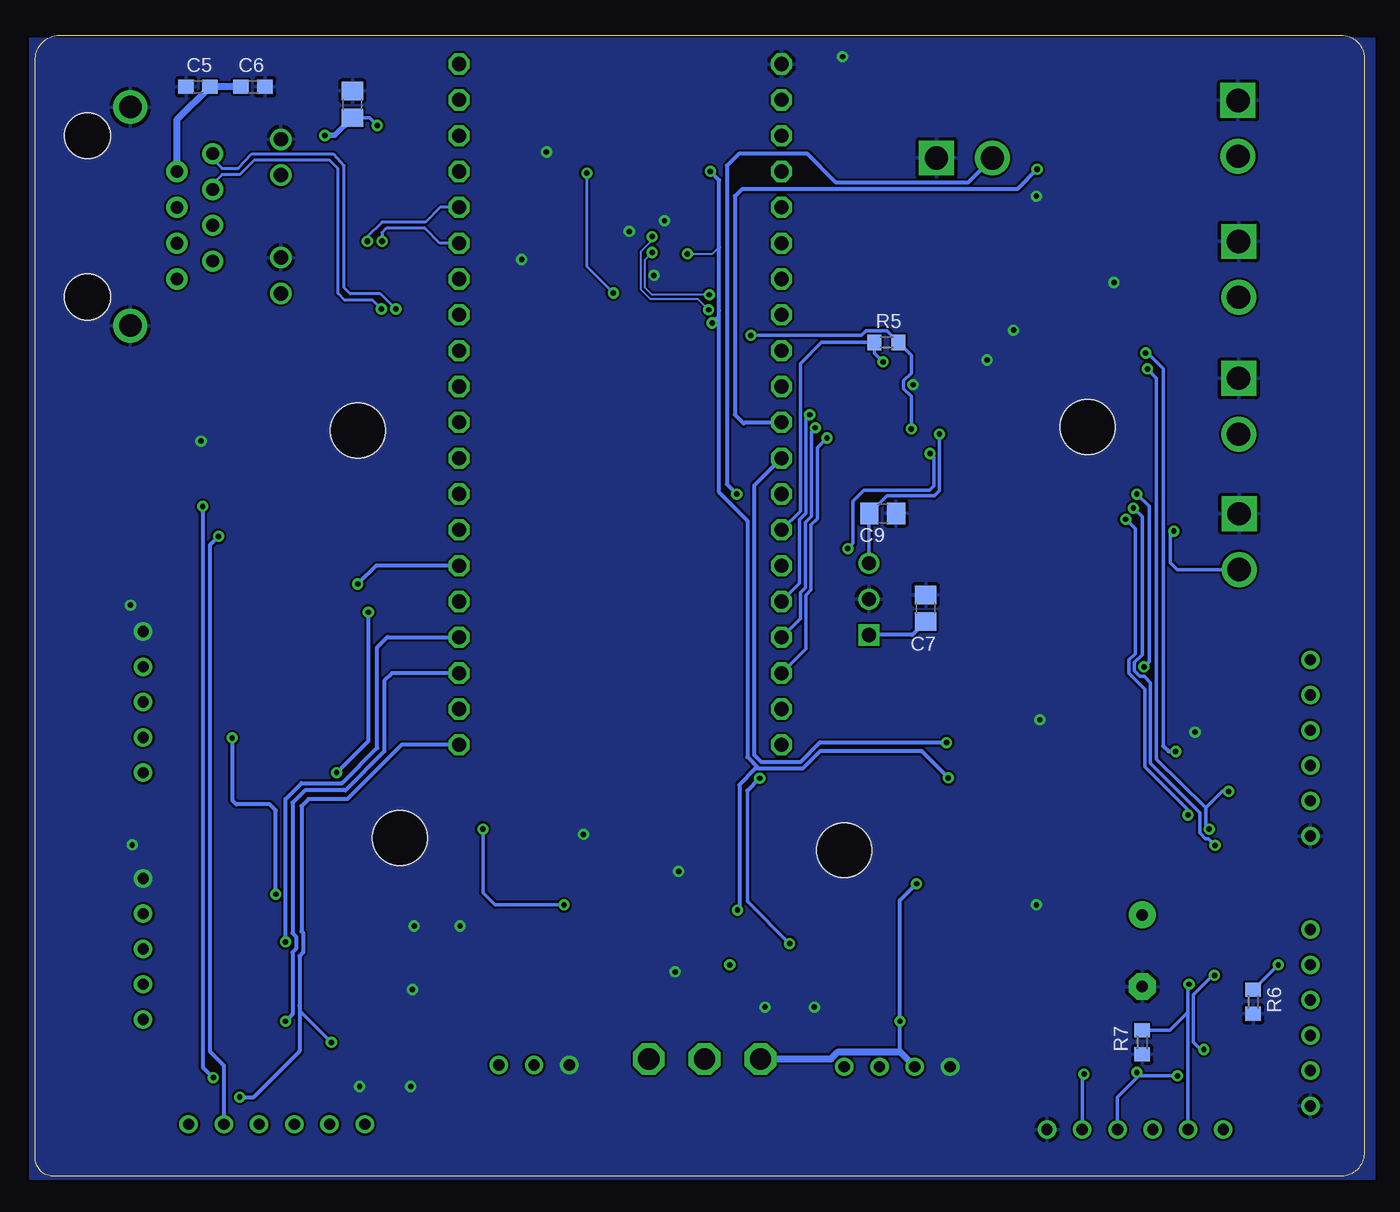
[diagram p6: board, bottom side, seen from below]

Size 94.25 x 80.9 mm. Coordinates in mm from the lower left corner, seen from the top.
Outline: 92.88,0 arc90 94.25,1.25 94.25,79.11 arc90 92.58,80.9 91.8,80.9 1.62,80.9 arc90 0,79.28 0,1.75 arc90 1.62,0 92.88,0
Copper layers (1*16): Top 0.0356mm / dielectric 63mil / Bottom 0.0356mm
Design rules "RJ2LayerDRU": minimum track width 6mil, minimum drill 15mil, track to track 6mil, track to pad 6mil, pad to pad 6mil, via to via 6mil, smd to smd 6mil, copper to edge 0mil, drill to drill 6mil, minimum pad ring 10mil, minimum via ring 8mil, stop-mask expansion 4mil, vias tented up to drill 0mil, thermal gap 10mil

### Footprints (pad centres in the part's own frame; a part is rotated, then mirrored left to right if it is on the bottom)
SPARKFUN-BOARDS_DIL40_0.9 = drill 1 pad 1.397 octagon: 1 -22.86,-11.43; 2 -20.32,-11.43; 3 -17.78,-11.43; 4 -15.24,-11.43; 5 -12.7,-11.43; 6 -10.16,-11.43; 7 -7.62,-11.43; 8 -5.08,-11.43; 9 -2.54,-11.43; 10 0,-11.43; 11 2.54,-11.43; 12 5.08,-11.43; 13 7.62,-11.43; 14 10.16,-11.43; 15 12.7,-11.43; 16 15.24,-11.43; 17 17.78,-11.43; 18 20.32,-11.43; 19 22.86,-11.43; 20 25.4,-11.43; 21 25.4,11.43; 22 22.86,11.43; 23 20.32,11.43; 24 17.78,11.43; 25 15.24,11.43; 26 12.7,11.43; 27 10.16,11.43; 28 7.62,11.43; 29 5.08,11.43; 30 2.54,11.43; 31 0,11.43; 32 -2.54,11.43; 33 -5.08,11.43; 34 -7.62,11.43; 35 -10.16,11.43; 36 -12.7,11.43; 37 -15.24,11.43; 38 -17.78,11.43; 39 -20.32,11.43; 40 -22.86,11.43
C0603 = smd 1.1 x 1: 1 -0.85,0; 2 0.85,0
E5-5 = drill 0.813 pad 1.905: + -2.54,0 | drill 0.813 pad 1.905 octagon: - 2.54,0
C0805 = smd 1.3 x 1.5: 1 -0.95,0; 2 0.95,0
LED-0603 = smd 1 x 1: A -0.877,0; C 0.877,0
S3B-VH = drill 1.5 octagon: 1 1.95,7.2; 2 5.91,7.2; 3 9.87,7.2
B2PS-CENTERED = drill 1.65 square: 1 -1.98,0 | drill 1.65: 2 1.98,0
SOT23-6 = smd 0.55 x 1.2: 1 -0.95,-1.3; 2 0,-1.3; 3 0.95,-1.3; 4 0.95,1.3; 5 0,1.3; 6 -0.95,1.3
R0603 = smd 1 x 1.1: 1 -0.85,0; 2 0.85,0
RC0805N-L = smd 0.802 x 1.2: 1 0.519,-0.762; 2 2.021,-0.762
R-78E = drill 1 square: 1 -2.54,0 | drill 1: 2 0,0; 3 2.54,0
SOIC-8 = smd 0.61 x 1.52: 1 -1.905,-2.723; 2 -0.635,-2.723; 3 0.635,-2.723; 4 1.905,-2.723; 5 1.905,2.723; 6 0.635,2.723; 7 -0.635,2.723; 8 -1.905,2.723
PW16-M = smd 1.981 x 0.406: 1 -2.87,2.275; 2 -2.87,1.625; 3 -2.87,0.975; 4 -2.87,0.325; 5 -2.87,-0.325; 6 -2.87,-0.975; 7 -2.87,-1.625; 8 -2.87,-2.275; 9 2.87,-2.275; 10 2.87,-1.625; 11 2.87,-0.975; 12 2.87,-0.325; 13 2.87,0.325; 14 2.87,0.975; 15 2.87,1.625; 16 2.87,2.275
DBV5 = smd 1.473 x 0.559: 1 1.041,-0.574; 2 1.041,-1.524; 3 1.041,-2.474; 4 3.277,-2.474; 5 3.277,-0.574
SOT-23-5 = smd 0.6 x 1.2: 1 -0.95,-1.306; 2 0,-1.306; 3 0.95,-1.306; 4 0.95,1.306; 5 -0.95,1.306
SOIC8-N_MC = smd 1.55 x 0.6: 1 -0.75,-0.595; 2 -0.75,-1.865; 3 -0.75,-3.135; 4 -0.75,-4.405; 5 4.65,-4.405; 6 4.65,-3.135; 7 4.65,-1.865; 8 4.65,-0.595
BMI088 = smd 0.25 x 0.475: P$1 0,0; P$2 -0.5,0; P$3 -1,0; P$4 -1.5,0; P$5 -2,0; P$6 -2.5,0; P$7 -3,0; P$9 -3,-2.33; P$10 -2.5,-2.33; P$11 -2,-2.33; P$12 -1.5,-2.33; P$13 -1,-2.33; P$14 -0.5,-2.33; P$15 0,-2.33 | smd 0.475 x 0.25: P$8 -3.415,-1.16; P$16 0.415,-1.16
STANDOFF-HOLE = hole 3.9: 0,0
32005-400 = smd 3.1 x 0.5: 1 3,1.6; 2 3,0.8; 3 3,0; 4 3,-0.8; 5 3,-1.6 | smd 2.5 x 2: M1 -3,-4.45; M2 -3,4.45 | smd 3.3 x 2: M3 2.9,4.45; M4 2.9,-4.45
S5BEHLFSN = drill 0.8: X-1 2.5,2.1; X-2 5,2.1; X-3 7.5,2.1; X-4 10,2.1; X-5 12.5,2.1
B6BEHALFSN = drill 0.8: X-1 2.5,2.2; X-2 5,2.2; X-3 7.5,2.2; X-4 10,2.2; X-5 12.5,2.2; X-6 15,2.2
SI-50170 = drill 0.9 pad 1.5: 1 4.445,5.842; 2 3.175,3.302; 3 1.905,5.842; 4 0.635,3.302; 5 -0.635,5.842; 6 -1.905,3.302; 7 -3.175,5.842; 8 -4.445,3.302 | drill 1.016 pad 1.5: A1 -5.461,10.668; A2 2.921,10.668; C1 -2.921,10.668; C2 5.461,10.668 | drill 1.6 pad 2.2: S1 -7.747,0; S2 7.747,0 | hole 3.251: -5.715,-3.048; 5.715,-3.048
S4BEHLFSN = drill 0.8: X-1 2.5,2.1; X-2 5,2.1; X-3 7.5,2.1; X-4 10,2.1
S3BEHLFSN = drill 0.8: GND 7.5,2.1; RX 5,2.1; TX 2.5,2.1

### Placement (x,y rotation side)
A1  52.76,56 270 top
C1  36.26,77 90 top
C2  15.75,16 270 top
C3  49.75,16.75 270 top
C4  49.62,23.88 270 top
C5  82.7,77.25 180 bottom
C6  78.81,77.25 0 bottom
C7  31.1,40.28 90 bottom
C8  56.81,69.88 90 top
C9  34.15,47 0 bottom
C10  71.75,76 90 bottom
C11  42.5,14.5 270 top
C12  67.12,8.75 270 top
C13  63,16.38 90 top
C14  57.62,64.5 0 top
C15  57.62,61.5 0 top
D1  23.5,30.8 180 top
D2  23.5,20.8 180 top
D3  23.52,23.3 180 top
D4  23.5,25.8 180 top
D5  23.5,28.3 180 top
J1  40.88,1.13 0 top
J2  8.96,74.3 270 top
J3  8.9,64.3 270 top
J4  8.9,54.6 270 top
J5  8.88,45 270 top
J6  28.36,72.2 180 top
Q4  16.3,76.65 0 top
R1  27.5,30.83 0 top
R2  15.88,63.88 90 top
R3  19.12,9 180 top
R4  15.5,9 180 top
R5  33.88,59.13 0 bottom
R6  7.88,12.38 90 bottom
R7  15.75,9.5 90 bottom
R8  12.88,33.38 270 top
R9  71.75,19.13 270 top
R10  71.73,14.76 270 top
R11  60.62,12.25 270 top
R12  27.5,20.8 0 top
R13  35.38,14.5 270 top
R14  39.12,14.5 90 top
R15  70.62,8.75 90 top
R16  52.38,60.75 0 top
R17  52.38,57.75 0 top
R18  27.5,23.36 0 top
R19  27.5,25.8 0 top
R21  27.5,28.3 0 top
R25  21.16,76.25 90 top
T1  35.13,40.93 90 top
U1  18.66,69.5 90 top
U2  31.25,54.63 180 top
U3  65.25,14.88 0 top
U4  52.73,70.04 0 top
U5  57,22.25 270 top
U6  46.88,66.38 90 top
U7  65.12,19.25 0 top
U$1  [STANDOFF-HOLE]  19.63,53.13 0 top
U$2  [STANDOFF-HOLE]  36.88,23.13 0 top
U$3  [STANDOFF-HOLE]  68.38,24 0 top
U$4  [STANDOFF-HOLE]  71.38,52.88 0 top
U$5  [12V]  10.76,67.4 270 top
U$7  [12V]  10.63,57.9 270 top
U$10  [ROBOBUZZ_1.4X]  50.6,27.73 0 top
U$12  [SAFETY]  10.86,79.2 270 top
U$13  [LEFT]  76.53,10.68 90 top
U$14  [RIGHT]  76.53,28.28 90 top
U$16  [STMC]  32.66,70.9 180 top
X1  88,49.63 180 top
X2  84.5,23.63 270 top
X3  84.5,41.13 270 top
X4  1.62,39.13 270 top
X7  87.5,68.07 90 top
X8  1.62,20 270 top
X9  7.5,1.13 0 top
X10  39.38,9.88 180 top
X11  63.88,10 180 top
X12  68.38,1.5 0 top

### Tracks (layer width: path | path; a pad name or v marks a point on that pad's centre or on a via)
3V3_LED_R
  Top 0.4: D5.A R21.1
5V_LED_R
  Top 0.4: D4.A R19.1
12V_LED_R
  Top 0.4: D3.A 26.59,23.3 R18.1
+3V3  (via drill 0.38, 0.4)
  Top 0.152: U6.P$3 46.9,65.4 v48,65.4 48,65 | 48,65 48.62,64.38 U6.P$11 49.99,64.38 50.12,64.5 56.53,64.5 56.77,64.25 | U6.P$7 47.75,63.38 48,63.63 48,65 | C15.1 56.77,64.25 | 56.77,64.25 C14.1
  Top 0.2: R17.2 R16.2 53.23,62.6 v53.25,62.63
  Top 0.25: U5.5 C3.1 48.48,18.88 v44.45,18.88 | U2.2 v32.12,53 | v43.5,59.63 45.38,59.63 v46.25,60.5
  Top 0.3: R21.2 29.45,28.3 v29.5,28.25
  Bottom 0.152: v48,65.4 46.23,65.4 45.75,65.88
  Bottom 0.2: v53.25,62.63 55.12,64.5 v55.12,71.13
  Bottom 0.25: C10.1 70.55,75.05 v70,74.5 | v32.12,53 32.12,55.3 32.67,55.85 32.67,56.4 32.12,56.95 32.12,58.23 R5.2 33.85,59.95 35.34,59.95 35.67,59.63 v43.5,59.63 | v46.25,60.5 45.75,61 45.75,61.38
  Bottom 0.3: v29.5,28.25 31.38,30.13 38.61,30.13 39.81,28.92 42.94,28.92 42.95,28.93 | v46.38,71.25 45.75,70.63 45.75,65.88 45.75,61.38 45.75,48.5 43.75,46.5 43.75,29.74 42.95,28.93 | 42.95,28.93 42.95,28.92 43.16,28.92 44.32,27.77 44.32,19 v44.45,18.88
  Bottom 0.406: C10.1 73,73.8 v73.7,73.8
  Bottom 0.5: C6.1 C5.1 84.2,74.9 X7.2
  pour Top: 78.91,70.35 80.75,68.5 80.75,53.88 82.13,52.5 94.86,52.5 94.86,80.75 19.41,80.75 19.41,70.35 20.93,68.85 37.8,68.85 39.3,70.35
+5V  (via drill 0.38)
  Top 0.25: U2.15 29.75,53 v30.12,52.63
  Top 0.3: 2.41,32.46 2.41,35.21 X4.X-1 | C12.1 67.12,11.57 U3.3
  Top 0.4: 36.42,76.32 A1.2 44,73.65 44,68
  Top 0.5: C1.1 36.42,76.32
  Top 1: T1.3 39.37,43.47
  Bottom 0.25: v30.12,52.63 30.12,48.63 30.5,48.25 33.84,48.25 C9.1 35.13,46.97 T1.3
  pour Top: -0.12,-0.85 -0.12,33.43 37.12,33.43 39,35.5 39,68.28 39.98,69.35 78.28,69.35 79.75,67.88 79.75,53.5 81.75,51.5 95.11,51.5 95.11,-0.81
+5V_ENCODER1  (via drill 0.38)
  Top 0.3: U7.5 70.92,18.68 R9.1 76.73,18.61 77.2,19.07 v77.2,20 | X3.X-4 80.33,31.13 v80.28,31.09
  Bottom 0.3: v80.28,31.09 80.28,26.66 80,26.38 77.62,26.38 77.2,25.95 v77.2,20
+5V_ENCODER2
  Top 0.3: U3.5 70.9,14.3 R10.1 79.63,14.24 80.25,13.63 X2.X-4
+12V
  Top 0.25: R18.2 29.48,23.36 30.75,24.63 30.75,35.63
  Bottom 0.3: C7.1 32.05,38.39 T1.1
  pour Top: 18.38,80.7 18.38,69.97 20.4,67.95 36.95,67.95 37.76,67.15 37.76,35.75 36.51,34.5 -0.7,34.5 -0.9,80.7
+24V  (via drill 0.38)
  Top 0.3: v31.75,20.75 31.7,20.8 R12.2 | R13.2 35.38,11.9 33.83,11.9 v32.93,11
  Bottom 0.3: 32.93,8.83 v32.93,11 32.93,19.57 v31.75,20.75
  Bottom 0.5: J1.1 37.82,8.33 37.31,8.83 32.93,8.83 X10.X-3
BATTIN  (via drill 0.38)
  Top 0.3: R14.2 40.27,16.5 v40.75,16.5 | v42.88,28.23 42.38,28.72 42.38,31.04 41.33,32.09 A1.19
  Top 0.4: R13.1 R14.2 C11.1 44.65,15.35 v45,15
  Bottom 0.25: v40.75,16.5 43.75,19.5 43.75,27.35
  Bottom 0.3: 43.75,27.35 v42.88,28.23
CANH
  Top 0.25: U5.7 55.13,16.12 56.4,14.85 59.15,14.85 60.62,13.38 R11.1 61.62,12.1 61.62,8.15 X11.TX
CANL
  Top 0.25: U5.6 53.87,15.14 54.88,14.13 58.15,14.13 58.88,13.4 58.88,12.25 | X11.RX 58.88,12.25 | R11.2 60.27,11.75 59.38,11.75 58.88,12.25
CON_CONNECTED  (via drill 0.38)
  Top 0.3: X12.X-6 81.45,5.63 v79.75,5.63 | R15.2 70.72,9.5 v73.25,9.5
  Bottom 0.25: v73.25,9.5 75.5,11.75 75.5,12.13
  Bottom 0.3: A1.21 68.28,30.6 72.12,26.75 74.88,26.75 75.38,26.25 75.38,17.38 75.25,17.25 75.25,15.88 75.5,15.63 75.5,12.13 75.5,8.88 78.75,5.63 v79.75,5.63
D_N
  Top 0.2: A1.32 65.3,57.43 66.25,57.43 arc90 66.54,57.72 66.54,57.83 arc-90 67.18,58.48 67.32,58.48 arc-90 67.96,57.83 67.96,57.72 arc90 68.25,57.43 69.81,57.43 arc90 70.1,57.72 70.1,57.73 arc-90 70.74,58.38 70.94,58.38 arc-90 71.58,57.73 71.58,57.72 arc90 71.88,57.43 72.45,57.43 arc90 72.74,57.72 72.74,57.83 arc-90 73.38,58.48 74.19,58.48 arc-90 74.83,57.83 74.83,57.72 arc90 75.12,57.43 87.82,57.43 88.55,56.7 88.55,49.68 87.95,49.07 87.25,49.07 87.01,48.83 X1.2
D_P
  Top 0.2: X1.3 87.05,49.63 87.25,49.43 87.8,49.43 88.2,49.82 88.2,56.55 87.68,57.07 75.12,57.07 arc-90 74.48,57.72 74.48,57.83 arc90 74.19,58.13 73.38,58.13 arc90 73.09,57.83 73.09,57.72 arc-90 72.45,57.07 71.88,57.07 arc-90 71.23,57.72 71.23,57.73 arc90 70.94,58.02 70.74,58.02 arc90 70.45,57.73 70.45,57.72 arc-90 69.81,57.07 68.25,57.07 arc-90 67.61,57.72 67.61,57.83 arc90 67.32,58.13 67.18,58.13 arc90 66.89,57.83 66.89,57.72 arc-90 66.25,57.07 65.36,57.07 64.28,56 A1.31
DIAG_RX  (via drill 0.38)
  Top 0.3: A1.27 80.78,45.84 v81.25,45.38
  Bottom 0.3: v81.25,45.38 81.88,44.75 81.88,8.88 80.88,7.88 X12.X-5
DIAG_TX  (via drill 0.38)
  Top 0.3: A1.28 81.5,48.38 v82.38,47.5 | v81.62,7 79.12,7 78.38,6.25 X12.X-4
  Bottom 0.3: v82.38,47.5 82.38,7.75 v81.62,7
ENCODER1_SENSE
  Top 0.3: X12.X-1 67.92,3.7 63.75,7.88 63.75,12.88 61.88,14.75 61.88,18 62.55,18.68 U7.1
ENCODER2_SENSE
  Top 0.3: X12.X-2 73.38,4.13 72.25,5.25 67.12,5.25 64.33,8.05 64.33,13.5 65.13,14.3 U3.1
ESTOP  (via drill 0.38)
  Top 0.25: v13.5,45.75 13.62,45.88 17.25,45.88 17.88,46.5 24.25,46.5 27.5,49.75 27.5,51.13 28,51.63 30.42,51.63 v30.8,51.25 | A1.15 41.33,44.08 40.89,44.51 v36.62,44.51
  Bottom 0.25: J5.2 13.27,43.02 13.75,43.5 13.75,45.5 v13.5,45.75 | v30.8,51.25 30.53,50.98 30.53,48.97 30.85,48.65 35.47,48.65 36.25,47.88 36.25,44.89 v36.62,44.51
FAN_PWM
  Top 0.4: X12.X-3 74.55,2.38 42.27,2.38 X10.X-1
GND  (via drill 0.38)
  Top 0.152: v49.62,67.75 49.62,66.8 U6.P$15 48.31,66.38 47.95,66.02 47.02,66.02 U6.P$2 46.73,65.73 46.54,65.73 46.41,65.6 46.41,65.16 46.54,65.02 46.73,65.02 U6.P$4 46.73,64.73 46.54,64.73 46.41,64.6 46.41,64.16 46.54,64.02 46.73,64.02 U6.P$6 | U6.P$10 v50.38,63.88 | C15.2 C14.2 58.98,65 v59.75,65
  Top 0.25: C3.2 48.88,15.03 v48.88,14.5 | C4.2 49.62,22.63 v48.62,21.63 | U5.2 55.38,23.24 v55.38,24.25 | U2.10 U2.9 27.41,57.88 v26.75,57.88 | U2.7 32.12,56.25 v32,56.13 | R8.2 12,31.65 v12,31.5
  Top 0.3: X1.5 84.11,52.13 v82.5,52.13 | U4.2 52.73,67.6 v52.12,67 | C8.2 58,72.02 v58,72.63 | C1.2 36.26,78.63 v37,79.38 | R2.1 16.23,63.38 v17.75,63.38 | U1.3 22.61,70.14 v23.25,69.5 | R14.1 39.12,12.13 v39,12 | C11.2 v42.5,12 | U3.2 67.4,13.35 v67.5,13.25 | U7.2 66.19,17.75 v67.38,17.75 | C12.2 67.12,6.88 v67.62,6.38 | R15.1 70.62,7 v71.25,6.38 | C13.2 63.6,17.23 v64.12,17.75 | X3.X-1 87.5,39.53 v87.5,40.5 | X2.X-1 86.6,22.73 v87.38,23.5
  Top 0.4: v23,32.38 22.62,32 D1.C D5.C D4.C 22.65,25.78 D3.C 22.62,23.28 D2.C 23.25,20.17 v23.25,19.25
  other vias: 24.88,60
  pour Bottom: -0.7,80.7 -0.7,-0.2 94.62,-0.2 94.62,80.7
INDICATOR_LED  (via drill 0.38)
  Top 0.3: R1.2 29.55,30.83 v29.62,30.75
  Bottom 0.3: v29.62,30.75 38.62,30.75 40,29.38 42.75,29.38 43.25,29.88 43.25,49 A1.12
INT1_ACCEL
  Top 0.152: U6.P$16 43.34,66.79 41.42,68.7 A1.5
INT2_ACCEL
  Top 0.152: A1.6 42.16,66.16 42.38,66.38 U6.P$1
INT3_GYRO  (via drill 0.38)
  Top 0.152: A1.7 45.38,63.62 46.45,62.55 v46.45,62.5 | v50.5,65.5 49.88,64.88 U6.P$12
  Bottom 0.152: v46.45,62.5 50.5,62.5 51,63 51,65 v50.5,65.5
INT4_GYRO  (via drill 0.38)
  Top 0.152: A1.8 41.69,61.44 v46.5,61.44 | v50.5,66.63 49.67,65.8 49.67,65.66 49.39,65.38 U6.P$13
  Bottom 0.152: v46.5,61.44 47.26,62.2 50.63,62.2 51.3,62.87 51.3,65.58 50.5,66.38 v50.5,66.63
LEA  (via drill 0.38)
  Top 0.3: X2.X-3 77,16.13
  Top 0.4: 77,16.13 v76.5,16.63
  Bottom 0.3: v76.5,16.63 76.5,26.75 75.38,27.88 72.5,27.88 70,30.38 70,37.5 69.25,38.25 69.22,38.22 A1.24
LEB  (via drill 0.38)
  Top 0.3: X2.X-5 76.62,11.13 v76.5,11
  Bottom 0.3: A1.23 68.94,35.68 69.5,35.13 69.5,30.13 72.25,27.38 75.12,27.38 76,26.5 76,17.25 75.75,17 75.75,16.13 76,15.88 76,11.5 v76.5,11
LIDAR_EN_1_3V3  (via drill 0.38)
  Top 0.25: U2.4 39.03,54.3 v39.33,54
  Bottom 0.25: v39.33,54 39.6,53.73 39.6,47 40.05,46.55 40.05,42.04 A1.16
LIDAR_EN_1_5V  (via drill 0.38)
  Top 0.25: v15.62,36.13 15.62,35 14.75,34.13 12.88,34.13 12.82,34.18 | v16.12,48.38 23.5,48.38 25.75,50.63 25.75,53.75 26.3,54.3 U2.13 | X4.X-2 12.78,34.13 12.82,34.18 | 12.82,34.18 R8.1
  Bottom 0.25: v15.62,36.13 15.25,36.5 15.25,47.5 v16.12,48.38
LIDAR_EN_2_3V3  (via drill 0.38)
  Top 0.25: U2.3 38.35,53.65 v38.93,53.07
  Bottom 0.25: v38.93,53.07 39.2,52.81 39.2,46.81 39.62,46.38 39.62,41.75 40,41.38 40,39.55 A1.17
LIDAR_EN_2_5V  (via drill 0.38)
  Top 0.25: U2.14 26.77,53.65 26.38,53.25 26.38,50.38 23.75,47.75 16.75,47.75 v16.38,47.38 | v10.58,23.47 10.72,23.33 10.72,15.47 10.25,15 v6.1,15 X8.X-2
  Bottom 0.25: v10.58,23.47 11.06,23.95 11.28,23.95 11.67,24.35 11.67,25.8 15.15,29.28 15.15,29.58 15.15,29.74 15.15,35 15.61,35.45 15.9,35.45 16.3,35.85 16.3,36.45 15.75,37 15.75,46.75 v16.38,47.38 | R6.2 v6.1,15
LIDAR_EN_3_3V3  (via drill 0.38)
  Top 0.25: U2.1 v38.1,52.35
  Bottom 0.25: A1.18 39.6,37.41 39.6,41.21 39.22,41.58 39.22,46.21 38.79,46.64 38.79,51.66 v38.1,52.35
LIDAR_EN_3_5V  (via drill 0.38)
  Top 0.25: v12.42,13.63 12.25,13.8 12.25,25.38 v12.5,25.63 | v16.91,46.59 17.45,47.13 24,47.13 27,50.13 27,51.88 27.48,52.35 U2.16
  Bottom 0.25: 12.53,11.63 12.53,13.52 v12.42,13.63 | v12.5,25.63 12.5,26 15.56,29.06 15.56,29.91 15.55,29.91 15.55,34.54 16.7,35.68 16.7,36.62 16.25,37.07 16.25,45.92 v16.91,46.59 | 12.53,11.63 13.78,10.38 15.72,10.38 R7.2 | X9.X-2 12.53,3.35 12.53,11.63
LVL_SHIFT_OE  (via drill 0.38)
  Top 0.25: v34.12,57.75 U2.8
  Bottom 0.25: v34.12,57.75 34.73,58.35 R5.1 38.5,59.13 40,57.63 40,47.17 A1.14
MBED_CAN_RD
  Top 0.25: A1.30 61.5,50.78 61.5,26.25 60.88,25.63 55.5,25.63 54.72,24.85 53.22,24.85 52.59,24.22 U5.4
MBED_CAN_TD
  Top 0.25: A1.29 62.05,48.79 62.05,25.93 61.25,25.13 57,25.13 56.41,24.53 U5.1
MOTOR_CTRL  (via drill 0.38)
  Top 0.3: v44.5,48.38 v44.49,48.38 A1.13
  Bottom 0.3: v44.5,48.38 45.2,49.08 45.2,71.65 44.35,72.5 39.5,72.5 37.45,70.45 28.12,70.45 J6.2
N$1
  Top 0.4: D2.A R12.1
N$2
  Top 0.4: D1.A 26.62,30.8 R1.1
RD_N  (via drill 0.4)
  Top 0.2: v70.7,66.3 69.81,67.2 80.06,67.2 81.09,66.16 X7.6
  Bottom 0.2: A1.36 65.54,68.7 66.58,67.66 69.66,67.66 70.7,66.61 v70.7,66.3
RD_P  (via drill 0.4 pad 0.3)
  Top 0.2: v69.66,66.3 68.95,67 69.61,67.65 80.06,67.65 81.11,68.7 X7.4
  Bottom 0.2: A1.35 65.56,66.16 66.61,67.21 69.36,67.21 69.66,66.91 v69.66,66.3
REA  (via drill 0.38)
  Top 0.3: v71.38,42 71.38,35.38 73.12,33.63 X3.X-3
  Bottom 0.3: A1.26 70.08,43.3 v71.38,42
REB  (via drill 0.38)
  Top 0.3: v72.88,28.63 72.95,28.55 73.03,28.63 X3.X-5 | v70.62,40 69.86,40.76 A1.25
  Bottom 0.3: v72.88,28.63 70.62,30.88 v70.62,40
SAFETY_HRD
  Top 0.5: J2.2 12.32,72.32 Q4.1 | Q4.1 Q4.2 Q4.5 Q4.6 Q4.1
SAFETY_LIGHT
  Top 0.5: R25.1 17.16,71.41 U1.5 15.03,71.41 14.38,70.75 14.38,65.88 15.53,64.73 R2.2
SAFETY_LIGHT_3V3  (via drill 0.4)
  Top 0.5: U1.4 v23.2,71.41 v23.2,71.4
  Bottom 0.3: v23.2,71.4 24.6,70 44.12,70 44.63,69.5 44.63,54 44,53.38 43.91,53.46 A1.11
SAFETY_R
  Top 0.5: Q4.3 19.4,75.35 R25.2
SCL_3V3
  Top 0.2: A1.10 43.08,57.75 R17.1 51.52,59.34 52.28,60.1 52.28,61.41 52.13,61.55 51.22,61.55 49.46,63.31 49.27,63.31 U6.P$9
  Top 0.25: U2.5 36.95,54.95 38,56 A1.10
SCL_5V  (via drill 0.38)
  Top 0.25: v11,24.63 11,24 11.25,23.75 11.25,13.75 | v15.38,57.25 15.82,57.7 22.05,57.7 24.8,54.95 U2.12 | X8.X-4 5.17,8.65 7.83,8.65 9.46,10.28 10.53,10.28 11.25,11 11.25,13.75 | v10.62,14.25 10.75,14.25 11.25,13.75 | v9.62,27.3 5.65,27.3 X4.X-4 | R4.1 16.35,7.6 v16.12,7.38 | v13.25,7.13 v11.38,9
  Bottom 0.25: v11,24.63 11.25,24.88 11.25,26.13 | v15.38,57.25 14.75,56.58 14.75,29.58 11.25,26.13 | v10.62,14.25 10.75,14.25 12.12,12.88 12.12,9.5 11.62,9 v11.38,9 | v9.62,27.3 10.08,27.3 11.25,26.13 | v16.12,7.38 15.94,7.19 | 15.94,7.19 15.88,7.13 v13.25,7.13 | X9.X-4 17.5,5.63 15.94,7.19
SDA_3V3
  Top 0.2: A1.9 49.31,58.54 R16.1 49.31,62.96 U6.P$8
  Top 0.25: U2.6 36.73,55.6 39.37,58.25 39.78,58.25 40.07,58.54 A1.9
SDA_5V  (via drill 0.38)
  Top 0.25: X8.X-5 4.58,8.25 8,8.25 9.62,9.88 12.38,9.88 | 12.38,9.88 11.75,10.5 11.75,28 | 11.75,28 13.38,29.63 v13.38,30.13 | U2.11 25.15,55.6 22.38,58.38 v15.5,58.38 | X4.X-5 10.38,26.63 11.75,28 | 12.38,9.88 19.1,9.88 R3.1 20,8.98 19.88,8.85 v19.88,7.25
  Bottom 0.25: 14.25,30.5 14.25,57.25 15.38,58.38 v15.5,58.38 | X9.X-5 20,7.13 v19.88,7.25
  Bottom 0.3: 14.25,30.5 13.88,30.13 v13.38,30.13
STANDBY  (via drill 0.38)
  Top 0.25: A1.22 62.53,31.49 62.53,24.66 v62.5,24.63 | U5.8 56.41,18.91 v56.75,19.25
  Bottom 0.25: v56.75,19.25 61.62,19.25 62.5,20.13 v62.5,24.63
TD_N  (via drill 0.4)
  Top 0.2: v69.69,61.49 70.33,62.13 69.89,62.58 65.23,62.58 A1.34
  Bottom 0.2: X7.3 81.66,70.36 81.01,71.02 79.74,71.02 78.69,72.07 73.4,72.07 72.78,71.45 72.78,62.59 72.31,62.13 70.33,62.13 v69.69,61.49
TD_P  (via drill 0.4)
  Top 0.2: v68.67,61.49 69.31,62.13 65.23,62.13 A1.33
  Bottom 0.2: X7.1 81.66,72.12 81.01,71.47 79.85,71.47 78.9,72.5 73.09,72.5 72.33,71.65 72.33,63 71.91,62.58 69.76,62.58 v68.67,61.49

### Text on the board
tPlace: RoboJackets / IGVC Logic Board / v0.2 | ESTOP | Lidar #1 | ERR | 3V3 | 5V | 12V | 24V | #2 | FAN | 24V | CAN | #3